# Altium project ALT0056 - Carnaval 2015 Universal PCB REV A.PrjPCB
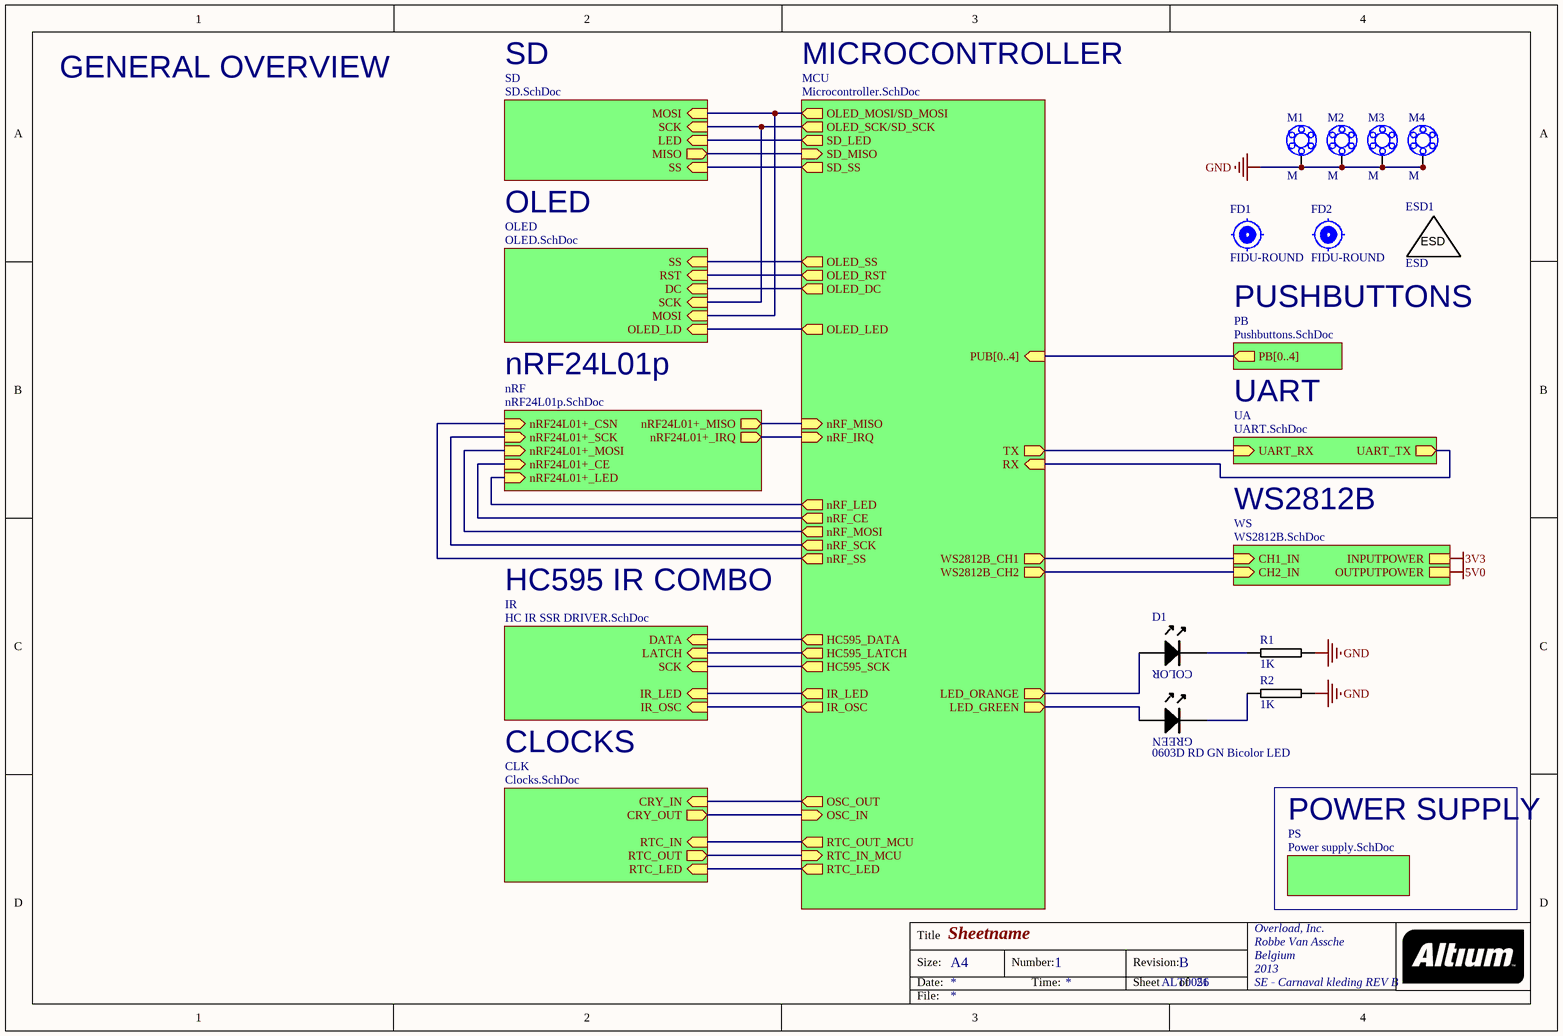
[diagram p0: General Overview.SchDoc]
21 sheets, 219 parts. Net scope: hierarchical (ports join the sheet entries above them; power ports are global).
Board file: PCB 2 layer 10 x 10.PcbDoc
Sheets:
  General Overview.SchDoc
    PS = Power supply.SchDoc
      BAT1 = Batterycharger.SchDoc
        CHRG = LEDs.SchDoc
        STBY = LEDs.SchDoc
      BAT2 = Batterycharger.SchDoc
        CHRG = LEDs.SchDoc
        STBY = LEDs.SchDoc
      3V30 = LEDs 0805.SchDoc
      5V00 = LEDs 0805.SchDoc
    WS = WS2812B.SchDoc
      CH1 = WS2812B Single Channel.SchDoc
      CH2 = WS2812B Single Channel.SchDoc
    PB = Pushbuttons.SchDoc
    MCU = Microcontroller.SchDoc
    UA = UART.SchDoc
    nRF = nRF24L01p.SchDoc
      nRFLED = LEDs.SchDoc
    IR = HC IR SSR DRIVER.SchDoc
      HC1 = HC595.SchDoc
      HC2 = HC595.SchDoc
      IRLED = LEDs.SchDoc
      IRL = IR LEDS.SchDoc
        NAND1 = Quad Nand.SchDoc
        NAND2 = Quad Nand.SchDoc
        IR0 = IR POWER STAGE.SchDoc
        IR1 = IR POWER STAGE.SchDoc
        IR2 = IR POWER STAGE.SchDoc
        IR3 = IR POWER STAGE.SchDoc
        IR4 = IR POWER STAGE.SchDoc
        IR5 = IR POWER STAGE.SchDoc
        IR6 = IR POWER STAGE.SchDoc
        IR7 = IR POWER STAGE.SchDoc
      SSR = SSR OUTPUTS.SchDoc
        SSR1 = SSR POWER STAGE.SchDoc
        SSR2 = SSR POWER STAGE.SchDoc
        SSR3 = SSR POWER STAGE.SchDoc
        SSR4 = SSR POWER STAGE.SchDoc
        SSR5 = SSR POWER STAGE.SchDoc
        SSR6 = SSR POWER STAGE.SchDoc
        SSR7 = SSR POWER STAGE.SchDoc
        SSR8 = SSR POWER STAGE.SchDoc
    CLK = Clocks.SchDoc
      RTCLED = LEDs.SchDoc
    SD = SD.SchDoc
      SDLED = LEDs.SchDoc
    OLED = OLED.SchDoc
      OLEDLED = LEDs.SchDoc

## Sheet General Overview.SchDoc: Sheetname
size A4; Organization: Overload, Inc.; Address1: Robbe Van Assche; Address2: Belgium; Address3: 2013; Address4: SE - Carnaval kleding REV B; DocumentNumber: 1; Revision: B; SheetNumber: ALT0056; SheetTotal: 21; PageSetup: Record=PageOptions|CenterHorizontal=True|CenterVertical=True|PrintScale=1.72|XCorrection=1.00|YCorrection=1.00|PrintKind=1|BorderSize=5000000|LeftOffset=0|BottomOffset=0|Orientation=2|PaperLength=1000|PaperWidth=1000|Scale=100|PaperSource=7|PrintQuality=-3|MediaType=1|DitherType=10|PrintScaleMode=1|PaperKind=A4|PaperIndex=9

### Parts
D1  0603D RD GN Bicolor LED  [0606LED BiCOLOR]
ESD1  ESD  [ESDSILK]  (no BOM)
FD1  FIDU-ROUND  [FIDU-ROUND]  (no BOM)
FD2  FIDU-ROUND  [FIDU-ROUND]  (no BOM)
M1  M  [MOUNTING]  (no BOM)
M2  M  [MOUNTING]  (no BOM)
M3  M  [MOUNTING]  (no BOM)
M4  M  [MOUNTING]  (no BOM)
R1  1K  [0603R-1k]
R2  1K  [0603R-1k]

### Sub-sheets
CLK = Clocks.SchDoc: RTC_IN (in), RTC_OUT (out), RTC_LED (in), CRY_IN (in), CRY_OUT (out)
IR = HC IR SSR DRIVER.SchDoc: SCK (in), LATCH (in), DATA (in), IR_OSC (in), IR_LED (in)
MCU = Microcontroller.SchDoc: RTC_LED (out), RTC_IN_MCU (in), RTC_OUT_MCU (out), OSC_IN (in), OSC_OUT (out), OLED_LED (out), SD_LED (out), TX (out), RX (in), SD_SS (out), OLED_SCK/SD_SCK (out), SD_MISO (in), OLED_MOSI/SD_MOSI (out), OLED_RST (out), OLED_DC (out), nRF_IRQ (in), nRF_CE (out), nRF_LED (out), nRF_SS (out), nRF_SCK (out), nRF_MISO (in), nRF_MOSI (out), WS2812B_CH1 (out), WS2812B_CH2 (out), OLED_SS (out), IR_LED (out), IR_OSC (out), HC595_DATA (out), HC595_LATCH (out), HC595_SCK (out), LED_GREEN (out), LED_ORANGE (out), PUB[0..4] (in)
nRF = nRF24L01p.SchDoc: nRF24L01+_CSN (in), nRF24L01+_SCK (in), nRF24L01+_MISO (out), nRF24L01+_MOSI (in), nRF24L01+_IRQ (out), nRF24L01+_CE (in), nRF24L01+_LED (in)
OLED = OLED.SchDoc: SS (in), RST (in), DC (in), SCK (in), MOSI (in), OLED_LD (in)
PB = Pushbuttons.SchDoc: PB[0..4] (out)
PS = Power supply.SchDoc: no entries
SD = SD.SchDoc: MOSI (in), SCK (in), MISO (out), SS (in), LED (in)
UA = UART.SchDoc: UART_RX (in), UART_TX (out)
WS = WS2812B.SchDoc: CH1_IN (in), CH2_IN (in), INPUTPOWER, OUTPUTPOWER

### Nets
GND: M1.1 M1.2 M1.3 M1.4 M1.5 M1.6 M1.7 M2.1 M2.2 M2.3 M2.4 M2.5 M2.6 M2.7 M3.1 M3.2 M3.3 M3.4 M3.5 M3.6 M3.7 M4.1 M4.2 M4.3 M4.4 M4.5 M4.6 M4.7 R1.2 R2.2
CH1_IN: sheet WS/CH1_IN, sheet MCU/WS2812B_CH1
CH2_IN: sheet WS/CH2_IN, sheet MCU/WS2812B_CH2
CRY_IN: sheet MCU/OSC_OUT, sheet CLK/CRY_IN
CRY_OUT: sheet MCU/OSC_IN, sheet CLK/CRY_OUT
DATA: sheet MCU/HC595_DATA, sheet IR/DATA
DC: sheet MCU/OLED_DC, sheet OLED/DC
HC595_LATCH: sheet MCU/HC595_LATCH, sheet IR/LATCH
HC595_SCK: sheet MCU/HC595_SCK, sheet IR/SCK
IR_LED: sheet MCU/IR_LED, sheet IR/IR_LED
IR_OSC: sheet MCU/IR_OSC, sheet IR/IR_OSC
LED: sheet MCU/SD_LED, sheet SD/LED
LED_GREEN: D1.A1 ; sheet MCU/LED_GREEN
LED_ORANGE: D1.A2 ; sheet MCU/LED_ORANGE
MISO: sheet MCU/SD_MISO, sheet SD/MISO
MOSI: sheet MCU/OLED_MOSI/SD_MOSI, sheet SD/MOSI, sheet OLED/MOSI
nRF24L01+_CE: sheet MCU/nRF_CE, sheet nRF/nRF24L01+_CE
nRF24L01+_CSN: sheet MCU/nRF_SS, sheet nRF/nRF24L01+_CSN
nRF24L01+_IRQ: sheet MCU/nRF_IRQ, sheet nRF/nRF24L01+_IRQ
nRF24L01+_LED: sheet MCU/nRF_LED, sheet nRF/nRF24L01+_LED
nRF24L01+_MISO: sheet MCU/nRF_MISO, sheet nRF/nRF24L01+_MISO
nRF24L01+_MOSI: sheet MCU/nRF_MOSI, sheet nRF/nRF24L01+_MOSI
nRF24L01+_SCK: sheet MCU/nRF_SCK, sheet nRF/nRF24L01+_SCK
OLED_LD: sheet MCU/OLED_LED, sheet OLED/OLED_LD
OLED_RST: sheet MCU/OLED_RST, sheet OLED/RST
OLED_SCK/SD_SCK: sheet MCU/OLED_SCK/SD_SCK, sheet SD/SCK, sheet OLED/SCK
OLED_SS: sheet MCU/OLED_SS, sheet OLED/SS
RTC_IN: sheet MCU/RTC_OUT_MCU, sheet CLK/RTC_IN
RTC_IN_MCU: sheet MCU/RTC_IN_MCU, sheet CLK/RTC_OUT
RTC_LED: sheet MCU/RTC_LED, sheet CLK/RTC_LED
RX: sheet MCU/RX, sheet UA/UART_TX
SD_SS: sheet MCU/SD_SS, sheet SD/SS
TX: sheet MCU/TX, sheet UA/UART_RX
NetD1_K1: D1.K1 R2.1
NetD1_K2: D1.K2 R1.1

### Buses and harness runs
bus sheet MCU/PUB[0..4] = sheet PB/PB[0..4]

### Notes on the sheet
- GENERAL OVERVIEW
- SD
- MICROCONTROLLER
- OLED
- PUSHBUTTONS
- nRF24L01p
- UART
- WS2812B
- HC595 IR COMBO
- CLOCKS
- POWER SUPPLY
- Title
- Size:
- Date:
- A4
- Number:
- Time:
- Revision:
- Sheet
- of
- File:
- (in symbol 0603D RD GN Bicolor LED) COLOR; GREEN

### Library data of the parts
D1 = 0603D RD GN Bicolor LED: Bicolor 0603 LED
ESD1 = ESD: ESD LOGO
FD1 FD2 = FIDU-ROUND: ROUND FIDUCIAL
M1-M4 = MOUNTING: MOUNTING HOLE - NON INSTALLABLE
R1 R2 = 0603R-1K: GENERIC RESISTOR 0603; Manufacturer Part Number: RMCF 1/16 1K 1% R; Manufacturer: Stackpole Electronics Inc; Reel: R14; Supplier 1: Digi-Key; Supplier Part Number 1: RMCF0603FT1K00TR-ND

## Sheet Power supply.SchDoc
size A4; DocumentNumber: 14; SheetNumber: ALT0056; SheetTotal: 21
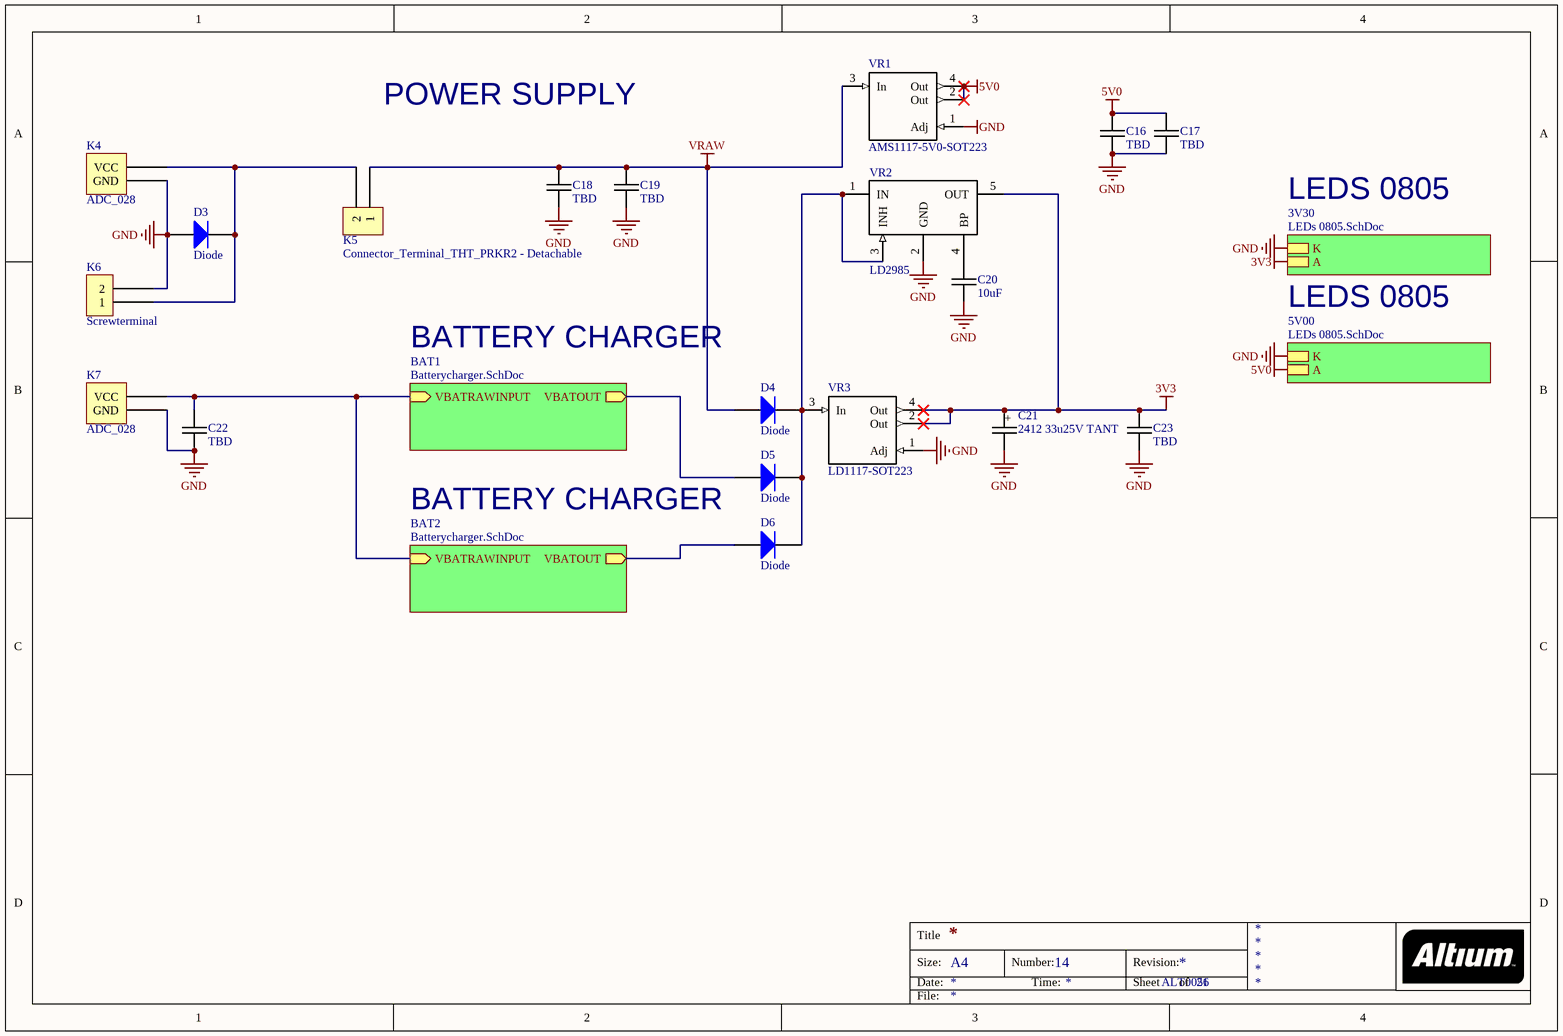
[diagram p1: Power supply.SchDoc]

### Parts
C16  TBD  [1210C-GENERIC]
C17  TBD  [1210C-GENERIC]
C18  TBD  [1210C-GENERIC]
C19  TBD  [1210C-GENERIC]
C20  10uF  [0603C-GENERIC]
C21  2412 33u25V TANT  [2412C+_TANTAL-33u25V]
C22  TBD  [1210C-GENERIC]
C23  TBD  [1210C-GENERIC]
D3  Diode  [SMB]
D4  Diode  [SMB]
D5  Diode  [SMB]
D6  Diode  [SMB]
K4  ADC_028  [ADC-028]
K5  Connector_Terminal_THT_PRKR2 - Detachable  [PRKR2-DET]
K6  Screwterminal  [PRKR2-DET]
K7  ADC_028  [ADC-028]
VR1  AMS1117-5V0-SOT223  [SOT223]
VR2  LD2985  [SOT23-5]
VR3  LD1117-SOT223  [SOT223]

### Sub-sheets
3V30 = LEDs 0805.SchDoc: K, A
5V00 = LEDs 0805.SchDoc: K, A
BAT1 = Batterycharger.SchDoc: VBATOUT (out), VBATRAWINPUT (in)
BAT2 = Batterycharger.SchDoc: VBATOUT (out), VBATRAWINPUT (in)

### Nets
3V3: C21.1 C23.1 VR2.5(OUT) VR3.2(Out) VR3.4(Out) ; sheet 3V30/A
5V0: C16.1 C17.1 VR1.2(Out) VR1.4(Out) ; sheet 5V00/A
GND: C16.2 C17.2 C18.2 C19.2 C20.2 C21.2 C22.2 C23.2 D3.1(A) K4.GND K6.2 K7.GND VR1.1(Adj) VR2.2(GND) VR3.1(Adj) ; sheet 3V30/K, sheet 5V00/K
VRAW: C18.1 C19.1 D4.1(A) K5.1 VR1.3(In)
VBATOUT: D5.1(A) ; sheet BAT1/VBATOUT
VBATOUT: D6.1(A) ; sheet BAT2/VBATOUT  [a separate net that carries the same name]
VBATRAWINPUT: C22.1 K7.VCC ; sheet BAT1/VBATRAWINPUT, sheet BAT2/VBATRAWINPUT
NetC20_1: C20.1 VR2.4(BP)
NetD3_2: D3.2(K) K4.VCC K5.2 K6.1
NetD4_2: D4.2(K) D5.2(K) D6.2(K) VR2.1(IN) VR2.3(INH) VR3.3(In)

### Notes on the sheet
- POWER SUPPLY
- LEDS 0805
- BATTERY CHARGER
- Title
- Size:
- Date:
- A4
- Number:
- Time:
- Revision:
- Sheet
- of
- File:
- (in symbol 2412C-TANTAL SIZE C-33u25V) +

### Library data of the parts
C16-C19 C22 C23 = Passives_Capacitors_1210_1210C-TBD: CAPACITOR 1210 CERAMIC VALUE TO BE DETERMINED
C20 = 0603C-10UF-10V-X5R-TDK: CAPACITOR 0603 CERAMIC; Manufacturer Part Number: C1608X5R0J106M; Manufacturer: TDK Corporation; Reel: C31; Supplier 1: Digi-Key; Supplier Part Number 1: 445-4112-2-ND
C21 = 2412C-TANTAL SIZE C-33u25V
D3-D6 = Diode: Default Diode; Published: 8-Jun-2000; LatestRevisionDate: 17-Jul-2002; LatestRevisionNote: Re-released for DXP Platform.; PackageVersion: Sep-1996; PackageReference: SMC; Publisher: Altium Limited; PackageDescription: DO-214-AB/SMC; 2 C-Bend Leads; Body 7.9 x 5.9 mm, inc. leads (LxW); Code_JEDEC: DO-214-AB
K4 K7 = ADC_028: 5.5mm SMD
K6 = Connector_Terminal_THT_PRKR2 - Detachable
VR1 = LD1117-SOT223
VR2 = LD2985: Low Noise Low Drop Voltage Regulator  with Inhibit; Text Field1: ST; Text Field2: LK112SM33TR; Text Field3: ST; Text Field4: LK112SM33TR

## Sheet Batterycharger.SchDoc
size A4; DocumentNumber: 15; SheetNumber: ALT0056; SheetTotal: 21
Used 2 times, as channels PS/BAT1, PS/BAT2. Parts and nets are listed once, with the designators drawn on the sheet.
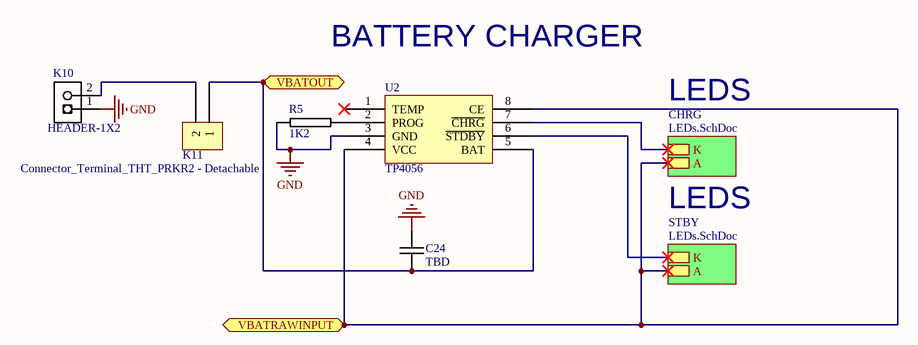
[diagram p2: Batterycharger.SchDoc]

### Parts
C24  TBD  [1210C-GENERIC]
K10  HEADER-1X2  [HEADER-1X2]
K11  Connector_Terminal_THT_PRKR2 - Detachable  [PRKR2-DET]
R5  1K2  [0603R-GENERIC]
U2  TP4056  [SO8_N]

### Sub-sheets
CHRG = LEDs.SchDoc: K, A
STBY = LEDs.SchDoc: K, A

### Ports
VBATOUT (out), VBATRAWINPUT (in)

### Nets
GND: C24.1 K10.1 R5.1 U2.3(GND)
VBATOUT: C24.2 K11.1 U2.5(BAT) ; port VBATOUT
VBATRAWINPUT: U2.4(VCC) U2.8(CE) ; port VBATRAWINPUT, sheet CHRG/A, sheet STBY/A
NetK10_2: K10.2 K11.2
NetR5_2: R5.2 U2.2(PROG)
NetU2_6: U2.6(~{STDBY}) ; sheet STBY/K
NetU2_7: U2.7(~{CHRG}) ; sheet CHRG/K

Not connected (* = marked no-connect by the designer): U2 1(TEMP)*

### Channels
PS/BAT1: designators end in A; ports VBATOUT=VBATOUT VBATRAWINPUT=VBATRAWINPUT
PS/BAT2: designators end in B; ports VBATOUT=VBATOUT VBATRAWINPUT=VBATRAWINPUT

### Notes on the sheet
- BATTERY CHARGER
- LEDS
- Title
- Size:
- Date:
- A4
- Number:
- Time:
- Revision:
- Sheet
- of
- File:

### Library data of the parts
C24 = Passives_Capacitors_1210_1210C-TBD: as C16 on sheet Power supply
K10 = HEADER-1X2: REEL: TH; Supplier 1: Digi-Key; Supplier Part Number 1: S1011E-36-ND
R5 = 0603R-1K2: GENERIC RESISTOR 0603; Manufacturer Part Number: RMCF 1/16 1.2K 1% R; Manufacturer: Stackpole Electronics Inc; Reel: R75; Supplier 1: Digi-Key; Supplier Part Number 1: RMCF0603FT1K20TR-ND

## Sheet LEDs.SchDoc
size A4; DocumentNumber: 3; SheetNumber: ALT0056; SheetTotal: 21
Used 9 times, as channels PS/BAT1/CHRG, PS/BAT1/STBY, PS/BAT2/CHRG, PS/BAT2/STBY, nRF/nRFLED, IR/IRLED, CLK/RTCLED, SD/SDLED, OLED/OLEDLED. Parts and nets are listed once, with the designators drawn on the sheet.
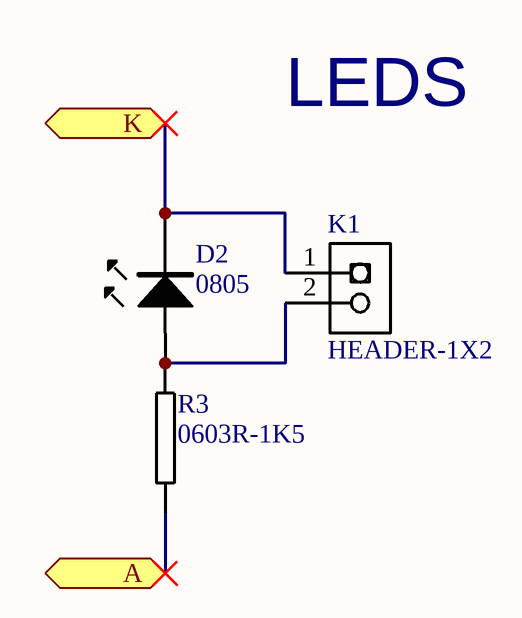
[diagram p3: LEDs.SchDoc]

### Parts
D2  0805  [0805LED]
K1  HEADER-1X2  [HEADER-1X2]
R3  0603R-1K5  [0603R-1k5]

### Ports
A, K

### Nets
A: R3.2 ; port A
K: D2.K K1.1 ; port K
NetD2_A: D2.A K1.2 R3.1

### Channels
PS/BAT1/CHRG: designators end in A; ports A=VBATRAWINPUT K=K
PS/BAT1/STBY: designators end in B; ports A=VBATRAWINPUT K=K
PS/BAT2/CHRG: designators end in C; ports A=VBATRAWINPUT K=K
PS/BAT2/STBY: designators end in D; ports A=VBATRAWINPUT K=K
nRF/nRFLED: designators end in E; ports A=nRF24L01+_LED K=GND
IR/IRLED: designators end in F; ports A=IR_LED K=GND
CLK/RTCLED: designators end in G; ports A=RTC_LED K=GND
SD/SDLED: designators end in H; ports A=LED K=GND
OLED/OLEDLED: designators end in I; ports A=OLED_LD K=GND

### Notes on the sheet
- LEDS
- Title
- Size:
- Date:
- A4
- Number:
- Time:
- Revision:
- Sheet
- of
- File:

### Library data of the parts
D2 = 0805_LED
K1 = HEADER-1X2: REEL: TH; Supplier 1: Digi-Key; Supplier Part Number 1: S1011E-36-ND
R3 = 0603R-1K5: GENERIC RESISTOR 0603; Manufacturer Part Number: RMCF 1/16 15K 1% R; Manufacturer: Stackpole Electronics Inc; Tolerance: ±1%; Resistance In Ohms: 15.0K; Power (Watts): 0.1W, 1/10W; Temperature Coefficient: ±100ppm/°C; Supplier 1: Digi-Key; Supplier Part Number 1: RMCF1/1615KFRTR-ND; Supplier: Digi-Key; Supplier Part Number: RMCF1/1615KFRTR-ND; Packaging: Tape & Reel (TR); Category: Resistors; Case: 0603 (1608 metric); Composition: Thick Film; Lead Style: Surface Mount (SMD - SMT); RoHS: RoHS Compliant

## Sheet LEDs 0805.SchDoc
size A4; Organization: Altium Limited; Address1: L3, 12a Rodborough Rd; Address2: Frenchs Forest; Address3: NSW; Address4: Australia 2086; DocumentNumber: 16; SheetNumber: ALT0056; SheetTotal: 21
Used 2 times, as channels PS/3V30, PS/5V00. Parts and nets are listed once, with the designators drawn on the sheet.
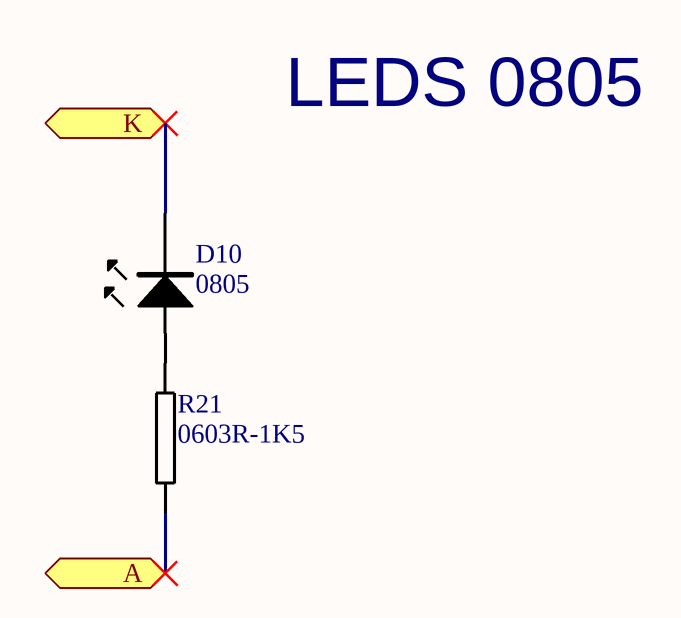
[diagram p4: LEDs 0805.SchDoc]

### Parts
D10  0805  [0805LED]
R21  0603R-1K5  [0603R-1k5]

### Ports
A, K

### Nets
A: R21.2 ; port A
K: D10.K ; port K
NetD10_A: D10.A R21.1

### Channels
PS/3V30: designators end in A; ports A=3V3 K=GND
PS/5V00: designators end in B; ports A=5V0 K=GND

### Notes on the sheet
- LEDS 0805
- Title
- Size:
- Date:
- A4
- Number:
- Time:
- Revision:
- Sheet
- of
- File:

### Library data of the parts
D10 = 0805_LED
R21 = 0603R-1K5: as R3 on sheet LEDs; Supplier 1: Digi-Key; Supplier Part Number 1: RMCF1/1615KFRTR-ND; Supplier: Digi-Key; Supplier Part Number: RMCF1/1615KFRTR-ND; Packaging: Tape & Reel (TR); Category: Resistors; Case: 0603 (1608 metric); Composition: Thick Film; Lead Style: Surface Mount (SMD - SMT); RoHS: RoHS Compliant

## Sheet WS2812B.SchDoc
size A4; DocumentNumber: 20; SheetNumber: ALT0056; SheetTotal: 21
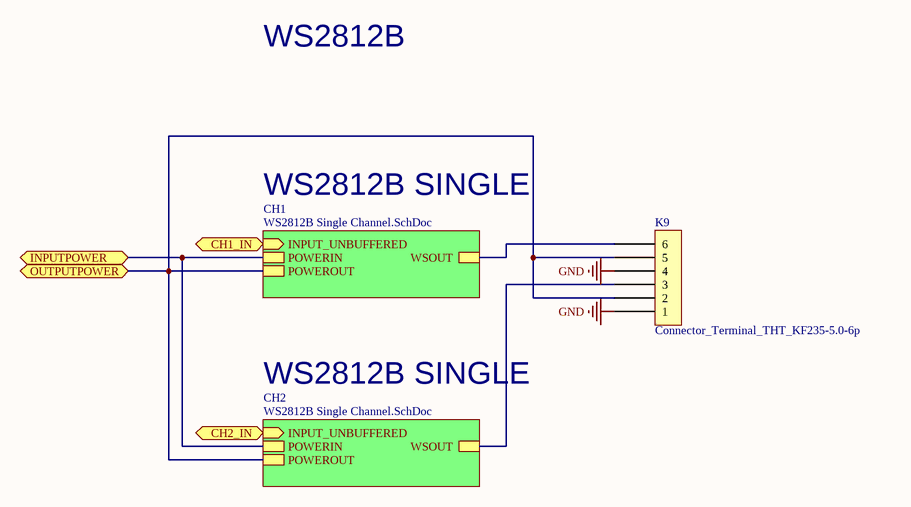
[diagram p5: WS2812B.SchDoc]

### Parts
K9  Connector_Terminal_THT_KF235-5.0-6p  [KF235-5.0-6p]

### Sub-sheets
CH1 = WS2812B Single Channel.SchDoc: INPUT_UNBUFFERED (in), POWERIN, POWEROUT, WSOUT
CH2 = WS2812B Single Channel.SchDoc: INPUT_UNBUFFERED (in), POWERIN, POWEROUT, WSOUT

### Ports
CH1_IN (in), CH2_IN (in), INPUTPOWER, OUTPUTPOWER

### Nets
3V3: port INPUTPOWER, sheet CH1/POWERIN, sheet CH2/POWERIN
5V0: K9.2 K9.5 ; port OUTPUTPOWER, sheet CH1/POWEROUT, sheet CH2/POWEROUT
GND: K9.1 K9.4
CH1_IN: port CH1_IN, sheet CH1/INPUT_UNBUFFERED
CH2_IN: port CH2_IN, sheet CH2/INPUT_UNBUFFERED
WSOUT: K9.6 ; sheet CH1/WSOUT
WSOUT: K9.3 ; sheet CH2/WSOUT  [a separate net that carries the same name]

### Notes on the sheet
- WS2812B
- WS2812B SINGLE
- Title
- Size:
- Date:
- A4
- Number:
- Time:
- Revision:
- Sheet
- of
- File:

## Sheet WS2812B Single Channel.SchDoc
size A4; DocumentNumber: 21; SheetNumber: ALT0056; SheetTotal: 21
Used 2 times, as channels WS/CH1, WS/CH2. Parts and nets are listed once, with the designators drawn on the sheet.
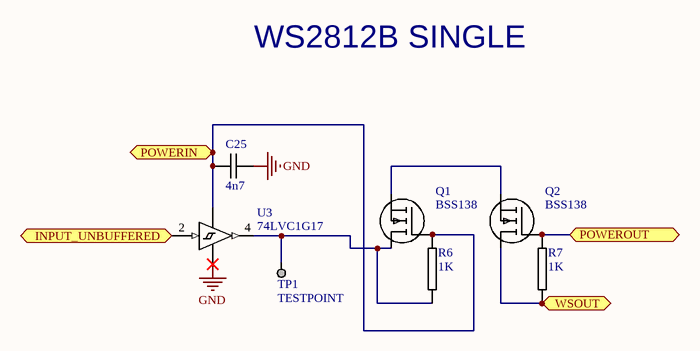
[diagram p6: WS2812B Single Channel.SchDoc]

### Parts
C25  4n7  [0603C-TBD]
Q1  BSS138  [SOT23-GDS]
Q2  BSS138  [SOT23-GDS]
R6  1K  [0603R-1k]
R7  1K  [0603R-1k]
TP1  TESTPOINT  [TESTPOINT]
U3  74LVC1G17  [SOT-353]

### Ports
INPUT_UNBUFFERED (in), POWERIN, POWEROUT, WSOUT

### Nets
GND: C25.2 U3.3(GND)
INPUT_UNBUFFERED: U3.2(A) ; port INPUT_UNBUFFERED
POWERIN: C25.1 Q1.G R6.1 U3.5(VCC) ; port POWERIN
POWEROUT: Q2.G R7.1 ; port POWEROUT
WSOUT: Q2.D R7.2 ; port WSOUT
NetQ1_D: Q1.D R6.2 TP1.1 U3.4(Y)
NetQ1_S: Q1.S Q2.S

### Channels
WS/CH1: designators end in A; ports INPUT_UNBUFFERED=CH1_IN POWERIN=3V3 POWEROUT=5V0 WSOUT=WSOUT
WS/CH2: designators end in B; ports INPUT_UNBUFFERED=CH2_IN POWERIN=3V3 POWEROUT=5V0 WSOUT=WSOUT

### Notes on the sheet
- WS2812B SINGLE
- Title
- Size:
- Date:
- A4
- Number:
- Time:
- Revision:
- Sheet
- of
- File:

### Library data of the parts
C25 = 0603C-4N7: CAPACITOR 0603 CERAMIC; REEL: C83; Supplier 1: Digi-Key; Supplier Part Number 1: 445-5086-2-ND
Q1 Q2 = BSS138-SOT23: N CHANNEL MOSFET BSS138 SOT23; Manufacturer: Fairchild Semiconductor; Manufacturer Part Number: 2N7002; Drain to Source Voltage (Vdss): 60V; Vgs(th) (Max) @ Id: 2.5V @ 250µA; Power - Max: 200mW; Current - Continuous Drain (Id) @ 25° C: 115mA; Rds On (Max) @ Id, Vgs: 7.5 Ohm @ 500mA, 10V; FET Type: MOSFET N-Channel, Metal Oxide; FET Feature: Logic Level Gate; Input Capacitance (Ciss) @ Vds: 50pF @ 25V; Reel: Q2; Supplier 1: Digi-Key; Supplier Part Number 1: 2N7002NTR-ND; Package / Case: SOT-23-3, TO-236-3, Micro3™, SSD3, SST3; RoHS: RoHS Compliant; Mounting Type: Surface Mount; Packaging: Tape & Reel (TR); Gate Charge (Qg) @ Vgs: -; Supplier Part Number: 2N7002NTR-ND; Supplier: Digi-Key; Category: Discrete Semiconductor Products
R6 R7 = 0603R-1K: as R1 on sheet General Overview; Supplier 1: Digi-Key; Supplier Part Number 1: RMCF0603FT1K00TR-ND
TP1 = TESTPOINT: TESTPOINT SCOPE GRABBER; Manufacturer Part Number: 5010; Manufacturer: Keystone Electronics; Reel: TH; Supplier 1: Digi-Key; Supplier Part Number 1: 5010K-ND
U3 = 74LVC1G17: Single buffer

## Sheet Pushbuttons.SchDoc
size A4; DocumentNumber: 17; SheetNumber: ALT0056; SheetTotal: 21
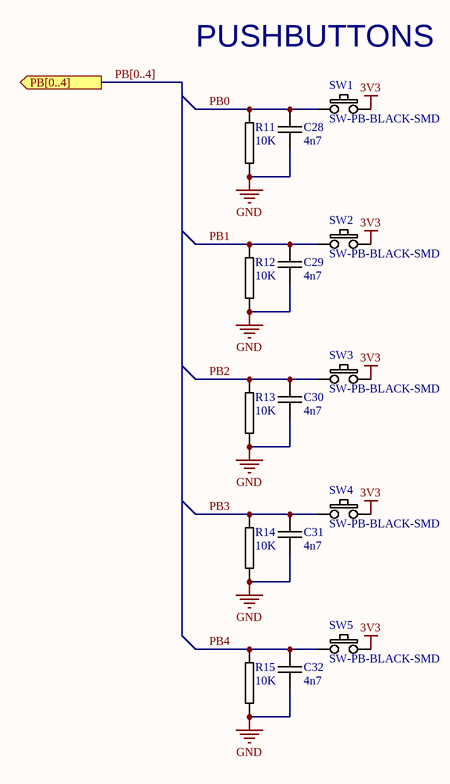
[diagram p7: Pushbuttons.SchDoc]

### Parts
C28  4n7  [0603C-TBD]
C29  4n7  [0603C-TBD]
C30  4n7  [0603C-TBD]
C31  4n7  [0603C-TBD]
C32  4n7  [0603C-TBD]
R11  10K  [0603R-10K]
R12  10K  [0603R-10K]
R13  10K  [0603R-10K]
R14  10K  [0603R-10K]
R15  10K  [0603R-10K]
SW1  SW-PB-BLACK-SMD  [SW-PB-SMD]
SW2  SW-PB-BLACK-SMD  [SW-PB-SMD]
SW3  SW-PB-BLACK-SMD  [SW-PB-SMD]
SW4  SW-PB-BLACK-SMD  [SW-PB-SMD]
SW5  SW-PB-BLACK-SMD  [SW-PB-SMD]

### Ports
PB[0..4] (out)

### Nets
3V3: SW1.2 SW2.2 SW3.2 SW4.2 SW5.2
GND: C28.2 C29.2 C30.2 C31.2 C32.2 R11.2 R12.2 R13.2 R14.2 R15.2
PB0: C28.1 R11.1 SW1.1
PB1: C29.1 R12.1 SW2.1
PB2: C30.1 R13.1 SW3.1
PB3: C31.1 R14.1 SW4.1
PB4: C32.1 R15.1 SW5.1

### Buses and harness runs
bus PB[0..4] = port PB[0..4]

### Notes on the sheet
- PUSHBUTTONS
- Title
- Size:
- Date:
- A4
- Number:
- Time:
- Revision:
- Sheet
- of
- File:

### Library data of the parts
C28-C32 = 0603C-4N7: CAPACITOR 0603 CERAMIC; REEL: C83; Supplier 1: Digi-Key; Supplier Part Number 1: 445-5086-2-ND
R11-R15 = 0603R-10K: GENERIC RESISTOR 0603; Manufacturer: Stackpole Electronics Inc; Manufacturer Part Number: RMCF 1/16 10K 1% R; Tolerance: ±1%; Power (Watts): 0.1W, 1/10W; Temperature Coefficient: ±100ppm/°C; Resistance In Ohms: 10.0K; Reel: R21; Category: Resistors; Supplier Part Number: RMCF1/1610KFRDKR-ND; Lead Style: Surface Mount (SMD - SMT); RoHS: RoHS Compliant; Packaging: Digi-Reel®; Case: 0603 (1608 metric); Composition: Thick Film; Supplier: Digi-Key; Supplier 1: Digi-Key; Supplier Part Number 1: RMCF0603FT10K0DKR-ND
SW1-SW5 = SW-PB-BLACK-SMD: PUSHBUTTON SWITCH 6MM SMD

## Sheet Microcontroller.SchDoc
size A4; DocumentNumber: 11; SheetNumber: ALT0056; SheetTotal: 21
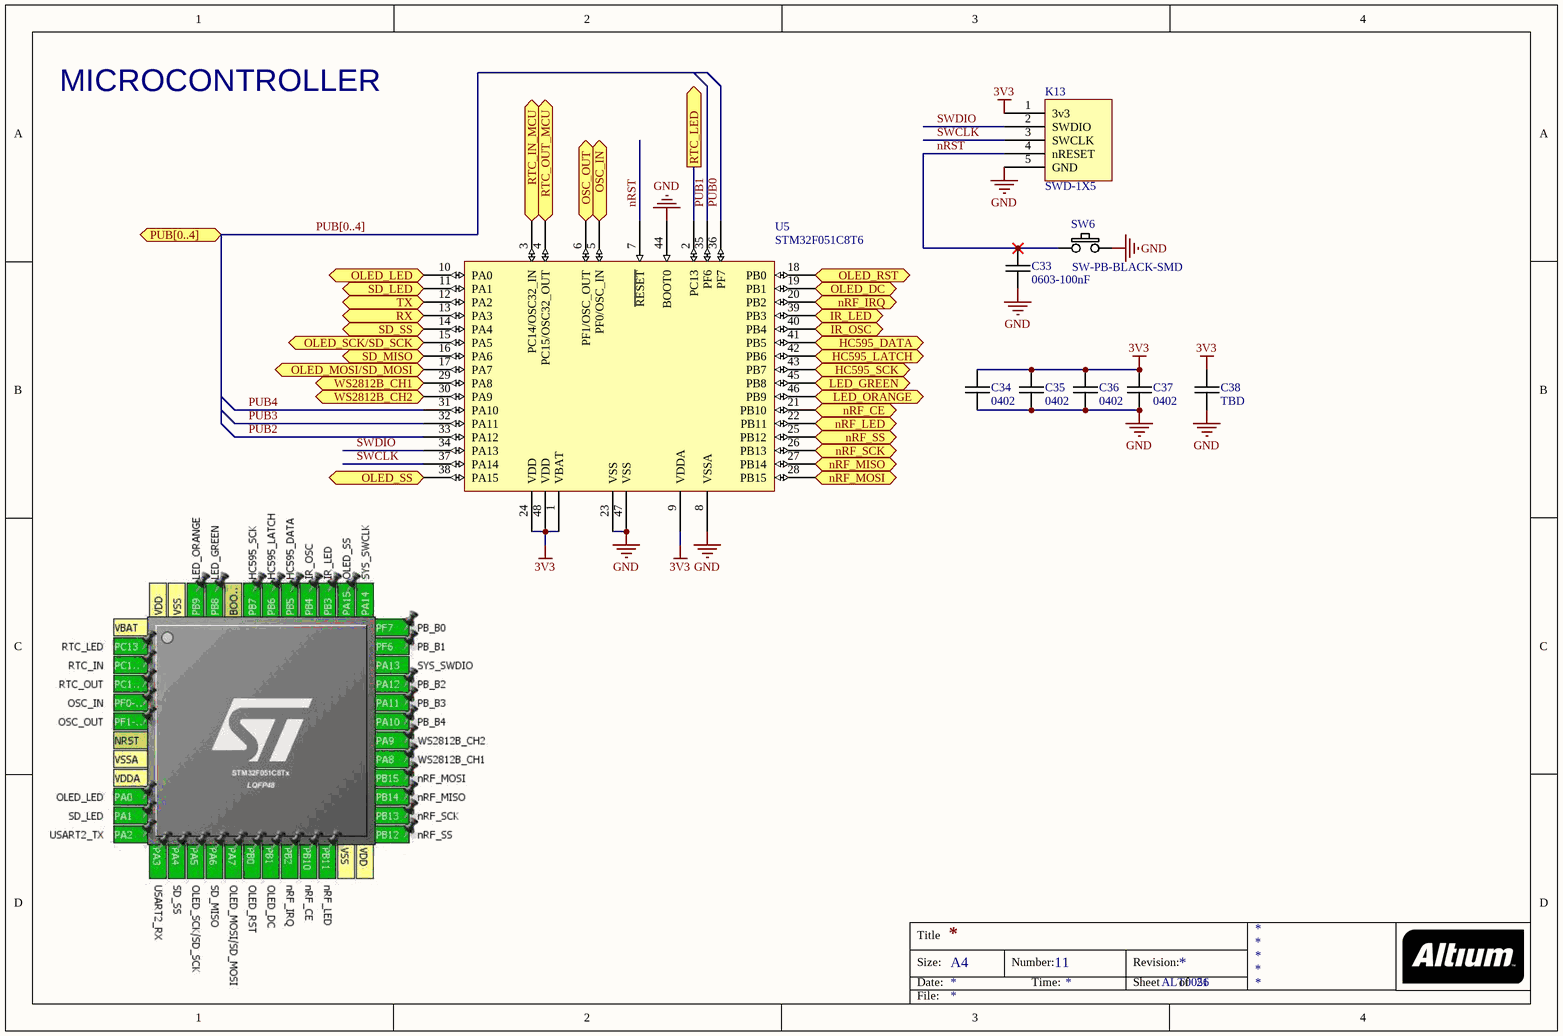
[diagram p8: Microcontroller.SchDoc]

### Parts
C33  0603-100nF  [0603C-TBD]
C34  0402  [0402C-TBD]
C35  0402  [0402C-TBD]
C36  0402  [0402C-TBD]
C37  0402  [0402C-TBD]
C38  TBD  [1210C-GENERIC]
K13  SWD-1X5  [HEADER-1X5]
SW6  SW-PB-BLACK-SMD  [SW-PB-SMD]
U5  STM32F051C8T6  [LQFP48_N]

### Ports
HC595_DATA (out), HC595_LATCH (out), HC595_SCK (out), IR_LED (out), IR_OSC (out), LED_GREEN (out), LED_ORANGE (out), nRF_CE (out), nRF_IRQ (in), nRF_LED (out), nRF_MISO (in), nRF_MOSI (out), nRF_SCK (out), nRF_SS (out), OLED_DC (out), OLED_LED (out), OLED_MOSI/SD_MOSI (out), OLED_RST (out), OLED_SCK/SD_SCK (out), OLED_SS (out), OSC_IN (in), OSC_OUT (out), PUB[0..4] (in), RTC_IN_MCU (in), RTC_LED (out), RTC_OUT_MCU (out), RX (in), SD_LED (out), SD_MISO (in), SD_SS (out), TX (out), WS2812B_CH1 (out), WS2812B_CH2 (out)

### Nets
3V3: C34.1 C35.1 C36.1 C37.1 C38.1 K13.1(3v3) U5.1(VBAT) U5.9(VDDA) U5.24(VDD) U5.48(VDD)
GND: C33.2 C34.2 C35.2 C36.2 C37.2 C38.2 K13.5(GND) SW6.2 U5.8(VSSA) U5.23(VSS) U5.44(BOOT0) U5.47(VSS)
CH1_IN: U5.29(PA8) ; port WS2812B_CH1
CH2_IN: U5.30(PA9) ; port WS2812B_CH2
CRY_IN: U5.6(PF1/OSC_OUT) ; port OSC_OUT
CRY_OUT: U5.5(PF0/OSC_IN) ; port OSC_IN
DATA: U5.41(PB5) ; port HC595_DATA
DC: U5.19(PB1) ; port OLED_DC
HC595_LATCH: U5.42(PB6) ; port HC595_LATCH
HC595_SCK: U5.43(PB7) ; port HC595_SCK
IR_LED: U5.39(PB3) ; port IR_LED
IR_OSC: U5.40(PB4) ; port IR_OSC
LED: U5.11(PA1) ; port SD_LED
LED_GREEN: U5.45(PB8) ; port LED_GREEN
LED_ORANGE: U5.46(PB9) ; port LED_ORANGE
MISO: U5.16(PA6) ; port SD_MISO
MOSI: U5.17(PA7) ; port OLED_MOSI/SD_MOSI
nRF24L01+_CE: U5.21(PB10) ; port nRF_CE
nRF24L01+_CSN: U5.25(PB12) ; port nRF_SS
nRF24L01+_IRQ: U5.20(PB2) ; port nRF_IRQ
nRF24L01+_LED: U5.22(PB11) ; port nRF_LED
nRF24L01+_MISO: U5.27(PB14) ; port nRF_MISO
nRF24L01+_MOSI: U5.28(PB15) ; port nRF_MOSI
nRF24L01+_SCK: U5.26(PB13) ; port nRF_SCK
nRST: C33.1 K13.4(nRESET) SW6.1 U5.7(~{RESET})  [project net nRST_ALT0056]
OLED_LD: U5.10(PA0) ; port OLED_LED
OLED_RST: U5.18(PB0) ; port OLED_RST
OLED_SCK/SD_SCK: U5.15(PA5) ; port OLED_SCK/SD_SCK
OLED_SS: U5.38(PA15) ; port OLED_SS
PUB0: U5.36(PF7)  [project net PB0]
PUB1: U5.35(PF6)  [project net PB1]
PUB2: U5.33(PA12)  [project net PB2]
PUB3: U5.32(PA11)  [project net PB3]
PUB4: U5.31(PA10)  [project net PB4]
RTC_IN: U5.4(PC15/OSC32_OUT) ; port RTC_OUT_MCU
RTC_IN_MCU: U5.3(PC14/OSC32_IN) ; port RTC_IN_MCU
RTC_LED: U5.2(PC13) ; port RTC_LED
RX: U5.13(PA3) ; port RX
SD_SS: U5.14(PA4) ; port SD_SS
SWCLK: K13.3(SWCLK) U5.37(PA14)  [project net SWCLK_ALT0056]
SWDIO: K13.2(SWDIO) U5.34(PA13)  [project net SWDIO_ALT0056]
TX: U5.12(PA2) ; port TX

### Buses and harness runs
bus PUB[0..4] = port PUB[0..4]

### Notes on the sheet
- MICROCONTROLLER
- Title
- Size:
- Date:
- A4
- Number:
- Time:
- Revision:
- Sheet
- of
- File:

### Library data of the parts
C33 = 0603C-TBD: CAPACITOR 0603 CERAMIC VALUE TO BE DETERMINED; REEL: *
C34-C37 = 0402C-TBD: CAPACITOR 0402 CERAMIC
C38 = Passives_Capacitors_1210_1210C-TBD: as C16 on sheet Power supply
K13 = SWD-1X5: SWD PINHEADER 1X5; REEL: TH; Supplier 1: Digi-Key; Supplier Part Number 1: S1011E-36-ND
SW6 = SW-PB-BLACK-SMD: PUSHBUTTON SWITCH 6MM SMD

## Sheet UART.SchDoc
size A4; DocumentNumber: 19; SheetNumber: ALT0056; SheetTotal: 21
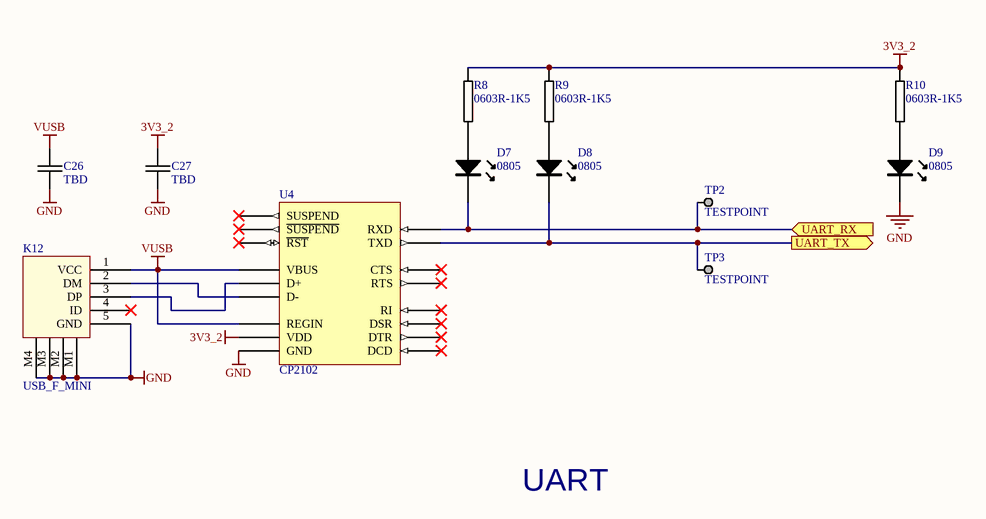
[diagram p9: UART.SchDoc]

### Parts
C26  TBD  [1210C-GENERIC]
C27  TBD  [1210C-GENERIC]
D7  0805  [0805LED]
D8  0805  [0805LED]
D9  0805  [0805LED]
K12  USB_F_MINI  [USB_F_MINI]
R8  0603R-1K5  [0603R-1k5]
R9  0603R-1K5  [0603R-1k5]
R10  0603R-1K5  [0603R-1k5]
TP2  TESTPOINT  [TESTPOINT]
TP3  TESTPOINT  [TESTPOINT]
U4  CP2102  [QFN-28]

### Ports
UART_RX (in), UART_TX (out)

### Nets
3V3_2: C27.1 R8.1 R9.1 R10.1 U4.6(VDD)
GND: C26.2 C27.2 D9.K K12.5(GND) K12.M1 K12.M2 K12.M3 K12.M4 U4.3(GND)
VUSB: C26.1 K12.1(VCC) U4.7(REGIN) U4.8(VBUS)
RX: D8.K TP3.1 U4.26(TXD) ; port UART_TX
TX: D7.K TP2.1 U4.25(RXD) ; port UART_RX
NetD7_A: D7.A R8.2
NetD8_A: D8.A R9.2
NetD9_A: D9.A R10.2
NetK12_2: K12.2(DM) U4.5(D-)
NetK12_3: K12.3(DP) U4.4(D+)

Not connected (* = marked no-connect by the designer): K12 4(ID)*; U4 1(DCD)* 2(RI)* 9(~{RST})* 11(~{SUSPEND})* 12(SUSPEND)* 23(CTS)* 24(RTS)* 27(DSR)* 28(DTR)*

### Notes on the sheet
- UART
- Title
- Size:
- Date:
- A4
- Number:
- Time:
- Revision:
- Sheet
- of
- File:

### Library data of the parts
C26 C27 = Passives_Capacitors_1210_1210C-TBD: as C16 on sheet Power supply
D7-D9 = 0805_LED
K12 = USB_F_MINI: MINI USB B FEMALE
R8-R10 = 0603R-1K5: as R3 on sheet LEDs; Supplier 1: Digi-Key; Supplier Part Number 1: RMCF1/1615KFRTR-ND; Supplier: Digi-Key; Supplier Part Number: RMCF1/1615KFRTR-ND; Packaging: Tape & Reel (TR); Category: Resistors; Case: 0603 (1608 metric); Composition: Thick Film; Lead Style: Surface Mount (SMD - SMT); RoHS: RoHS Compliant
TP2 TP3 = TESTPOINT: as TP1 on sheet WS2812B Single Channel; Supplier 1: Digi-Key; Supplier Part Number 1: 5010K-ND

## Sheet nRF24L01p.SchDoc
size A4; DocumentNumber: 12; SheetNumber: ALT0056; SheetTotal: 21
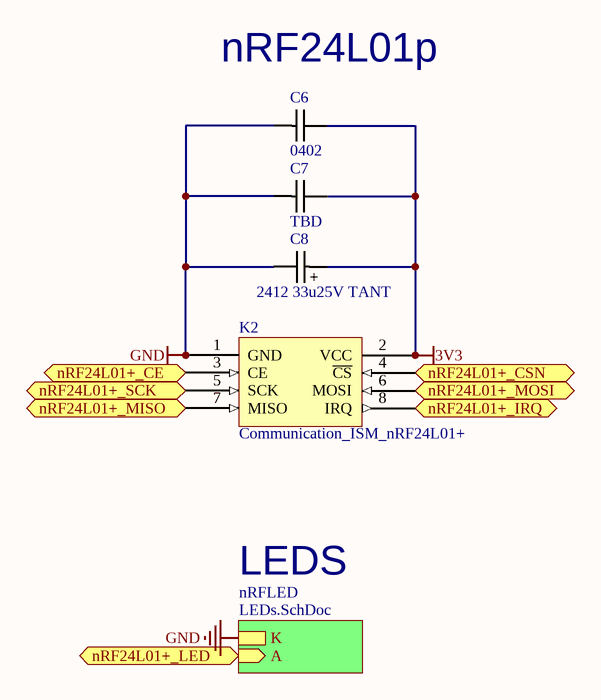
[diagram p10: nRF24L01p.SchDoc]

### Parts
C6  0402  [0402C-TBD]
C7  TBD  [1210C-GENERIC]
C8  2412 33u25V TANT  [2412C+_TANTAL-33u25V]
K2  Communication_ISM_nRF24L01+  [nRF24L01+_SMD]

### Sub-sheets
nRFLED = LEDs.SchDoc: K, A (in)

### Ports
nRF24L01+_CE (in), nRF24L01+_CSN (in), nRF24L01+_IRQ (out), nRF24L01+_LED (in), nRF24L01+_MISO (out), nRF24L01+_MOSI (in), nRF24L01+_SCK (in)

### Nets
3V3: C6.2 C7.2 C8.1 K2.2(VCC)
GND: C6.1 C7.1 C8.2 K2.1(GND) ; sheet nRFLED/K
nRF24L01+_CE: K2.3(CE) ; port nRF24L01+_CE
nRF24L01+_CSN: K2.4(~{CS}) ; port nRF24L01+_CSN
nRF24L01+_IRQ: K2.8(IRQ) ; port nRF24L01+_IRQ
nRF24L01+_LED: port nRF24L01+_LED, sheet nRFLED/A
nRF24L01+_MISO: K2.7(MISO) ; port nRF24L01+_MISO
nRF24L01+_MOSI: K2.6(MOSI) ; port nRF24L01+_MOSI
nRF24L01+_SCK: K2.5(SCK) ; port nRF24L01+_SCK

### Notes on the sheet
- (near C6) nRF24L01p
- LEDS
- Title
- Size:
- Date:
- A4
- Number:
- Time:
- Revision:
- Sheet
- of
- File:
- (in symbol 2412C-TANTAL SIZE C-33u25V) +

### Library data of the parts
C6 = 0402C-TBD: CAPACITOR 0402 CERAMIC
C7 = Passives_Capacitors_1210_1210C-TBD: as C16 on sheet Power supply
C8 = 2412C-TANTAL SIZE C-33u25V
K2 = Communication_ISM_nRF24L01+: nRF24L01+

## Sheet HC IR SSR DRIVER.SchDoc
size A4; DocumentNumber: 4; SheetNumber: ALT0056; SheetTotal: 21
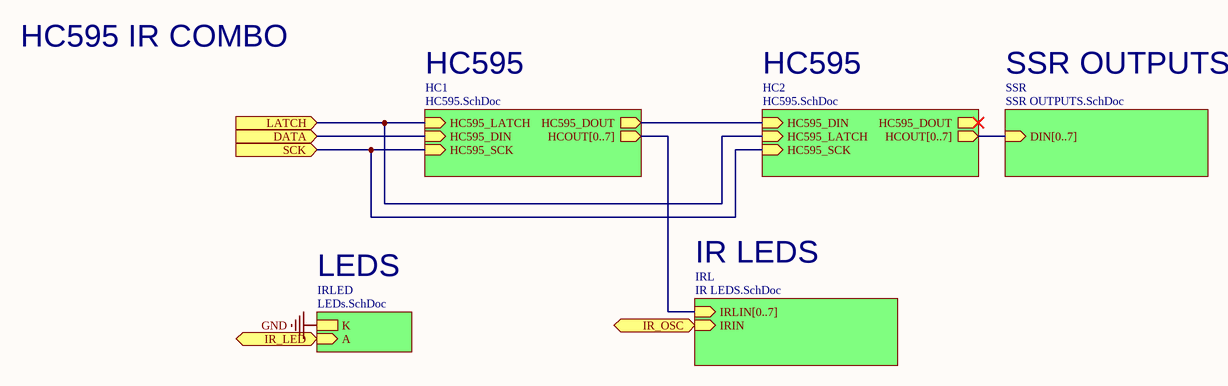
[diagram p11: HC IR SSR DRIVER.SchDoc]

### Sub-sheets
HC1 = HC595.SchDoc: HC595_LATCH (in), HC595_DIN (in), HC595_SCK (in), HC595_DOUT (out), HCOUT[0..7] (out)
HC2 = HC595.SchDoc: HC595_LATCH (in), HC595_DIN (in), HC595_SCK (in), HCOUT[0..7] (out), HC595_DOUT (out)
IRL = IR LEDS.SchDoc: IRLIN[0..7] (in), IRIN (in)
IRLED = LEDs.SchDoc: K, A (in)
SSR = SSR OUTPUTS.SchDoc: DIN[0..7] (in)

### Ports
DATA (in), IR_LED (in), IR_OSC (in), LATCH (in), SCK (in)

### Nets
DATA: port DATA, sheet HC1/HC595_DIN
HC595_DIN: sheet HC1/HC595_DOUT, sheet HC2/HC595_DIN
HC595_LATCH: port LATCH, sheet HC1/HC595_LATCH, sheet HC2/HC595_LATCH
HC595_SCK: port SCK, sheet HC1/HC595_SCK, sheet HC2/HC595_SCK
IR_LED: port IR_LED, sheet IRLED/A
IR_OSC: port IR_OSC, sheet IRL/IRIN

### Buses and harness runs
bus sheet HC1/HCOUT[0..7] = sheet IRL/IRLIN[0..7]
bus sheet HC2/HCOUT[0..7] = sheet SSR/DIN[0..7]

### Notes on the sheet
- HC595 IR COMBO
- HC595
- SSR OUTPUTS
- IR LEDS
- LEDS
- Title
- Size:
- Date:
- A4
- Number:
- Time:
- Revision:
- Sheet
- of
- File:

## Sheet HC595.SchDoc
size A4; DocumentNumber: 5; SheetNumber: ALT0056; SheetTotal: 21
Used 2 times, as channels IR/HC1, IR/HC2. Parts and nets are listed once, with the designators drawn on the sheet.
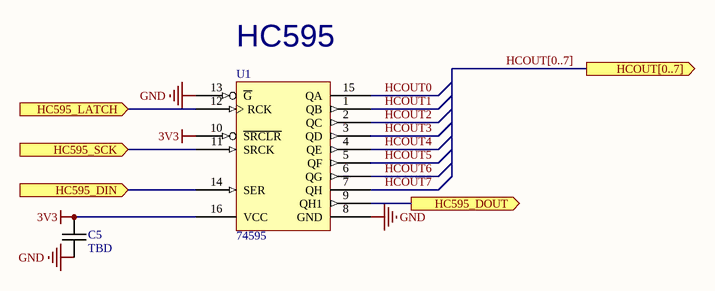
[diagram p12: HC595.SchDoc]

### Parts
C5  TBD  [1210C-GENERIC]
U1  74595  [SO16]

### Ports
HC595_DIN (in), HC595_DOUT (out), HC595_LATCH (in), HC595_SCK (in), HCOUT[0..7] (out)

### Nets
3V3: C5.1 U1.10(~{SRCLR}) U1.16(VCC)
GND: C5.2 U1.8(GND) U1.13(~{G})
HC595_DIN: U1.14(SER) ; port HC595_DIN
HC595_DOUT: U1.9(QH1) ; port HC595_DOUT
HC595_LATCH: U1.12(RCK) ; port HC595_LATCH
HC595_SCK: U1.11(SRCK) ; port HC595_SCK
HCOUT0: U1.15(QA)  [project net HCOUT0_ALT0056]
HCOUT1: U1.1(QB)  [project net HCOUT1_ALT0056]
HCOUT2: U1.2(QC)  [project net HCOUT2_ALT0056]
HCOUT3: U1.3(QD)  [project net HCOUT3_ALT0056]
HCOUT4: U1.4(QE)  [project net HCOUT4_ALT0056]
HCOUT5: U1.5(QF)  [project net HCOUT5_ALT0056]
HCOUT6: U1.6(QG)  [project net HCOUT6_ALT0056]
HCOUT7: U1.7(QH)  [project net HCOUT7_ALT0056]

### Channels
IR/HC1: designators end in A; ports HC595_DIN=DATA HC595_DOUT=HC595_DIN HC595_LATCH=HC595_LATCH HC595_SCK=HC595_SCK
IR/HC2: designators end in B; ports HC595_DIN=HC595_DIN HC595_DOUT=HC595_DOUT_HC2 HC595_LATCH=HC595_LATCH HC595_SCK=HC595_SCK

### Buses and harness runs
bus HCOUT[0..7] = port HCOUT[0..7]

### Notes on the sheet
- (near U1) HC595
- Title
- Size:
- Date:
- A4
- Number:
- Time:
- Revision:
- Sheet
- of
- File:

### Library data of the parts
C5 = Passives_Capacitors_1210_1210C-TBD: as C16 on sheet Power supply
U1 = 74595: 8-BIT SFT REG WIRTH OUTPUT LCH

## Sheet IR LEDS.SchDoc
size A4; DocumentNumber: 6; SheetNumber: ALT0056; SheetTotal: 21
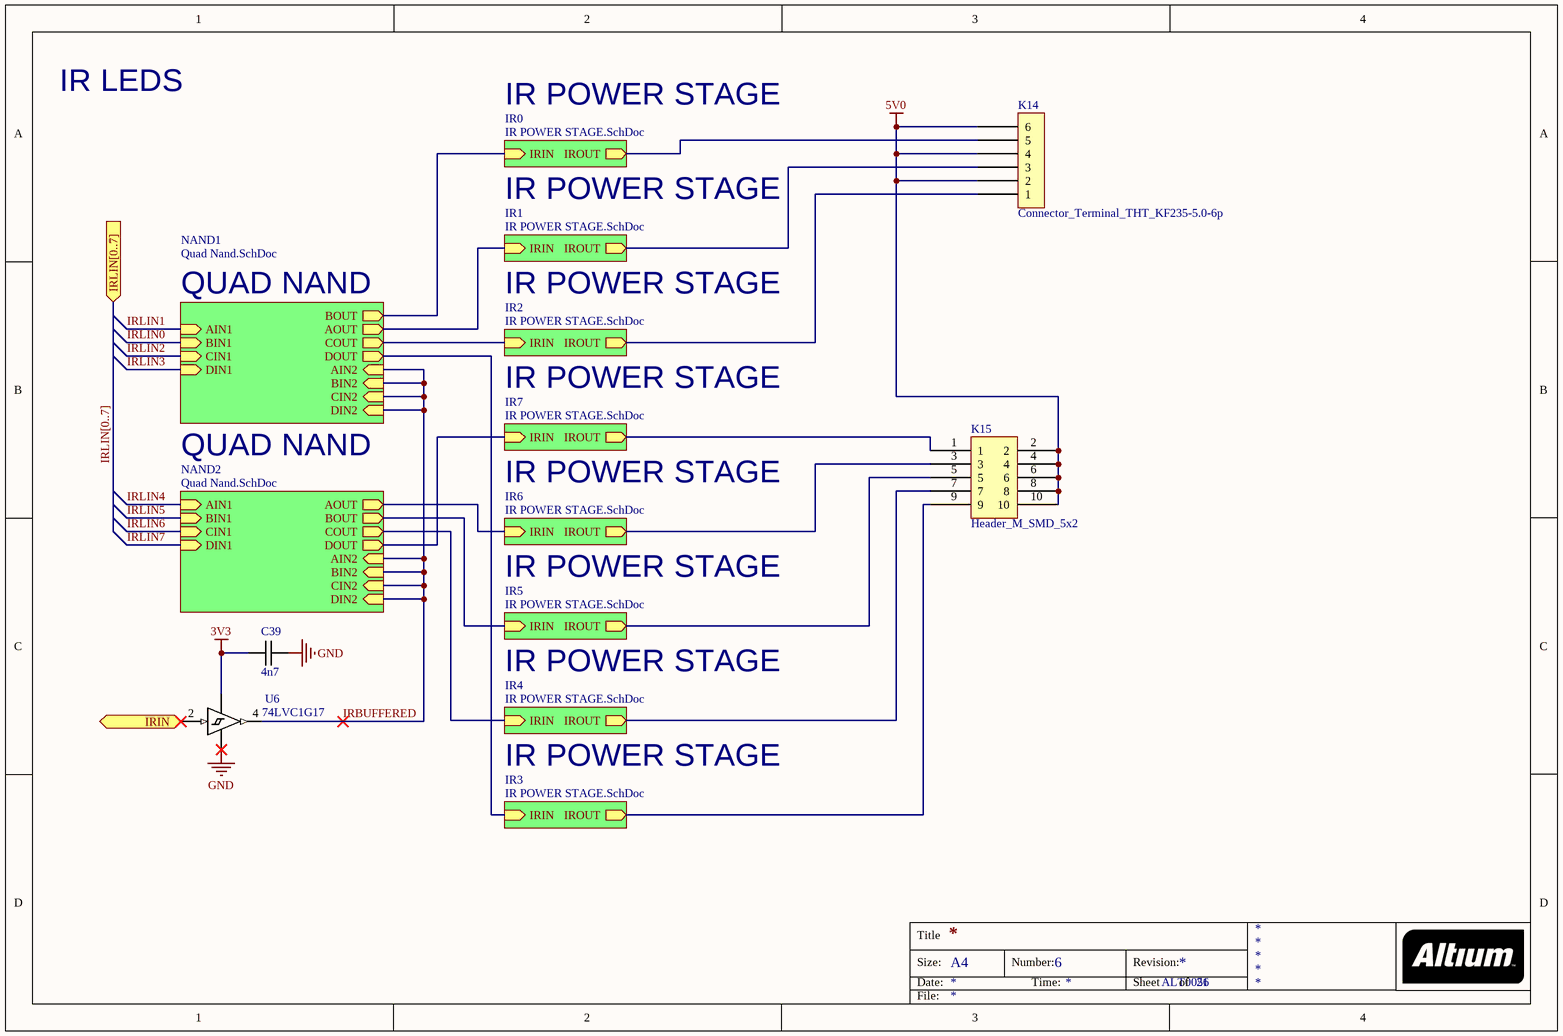
[diagram p13: IR LEDS.SchDoc]

### Parts
C39  4n7  [0603C-TBD]
K14  Connector_Terminal_THT_KF235-5.0-6p  [KF235-5.0-6p]
K15  Header_M_SMD_5x2  [Header_Male_2.54 5x2]
U6  74LVC1G17  [SOT-353]

### Sub-sheets
IR0 = IR POWER STAGE.SchDoc: IROUT (out), IRIN (in)
IR1 = IR POWER STAGE.SchDoc: IROUT (out), IRIN (in)
IR2 = IR POWER STAGE.SchDoc: IROUT (out), IRIN (in)
IR3 = IR POWER STAGE.SchDoc: IROUT (out), IRIN (in)
IR4 = IR POWER STAGE.SchDoc: IROUT (out), IRIN (in)
IR5 = IR POWER STAGE.SchDoc: IROUT (out), IRIN (in)
IR6 = IR POWER STAGE.SchDoc: IROUT (out), IRIN (in)
IR7 = IR POWER STAGE.SchDoc: IROUT (out), IRIN (in)
NAND1 = Quad Nand.SchDoc: BIN1 (in), BIN2 (in), BOUT (out), CIN1 (in), CIN2 (in), DIN1 (in), DIN2 (in), AIN1 (in), AIN2 (in), COUT (out), DOUT (out), AOUT (out)
NAND2 = Quad Nand.SchDoc: BIN1 (in), BIN2 (in), BOUT (out), CIN1 (in), CIN2 (in), DIN1 (in), DIN2 (in), AIN1 (in), AIN2 (in), COUT (out), DOUT (out), AOUT (out)

### Ports
IRIN (in), IRLIN[0..7] (in)

### Nets
3V3: C39.1 U6.5(VCC)
5V0: K14.2 K14.4 K14.6 K15.2 K15.4 K15.6 K15.8 K15.10
GND: C39.2 U6.3(GND)
AOUT: sheet NAND1/AOUT, sheet IR1/IRIN
AOUT: sheet NAND2/AOUT, sheet IR6/IRIN  [a separate net that carries the same name]
BOUT: sheet NAND1/BOUT, sheet IR0/IRIN
BOUT: sheet NAND2/BOUT, sheet IR5/IRIN  [a separate net that carries the same name]
COUT: sheet NAND1/COUT, sheet IR2/IRIN
COUT: sheet NAND2/COUT, sheet IR4/IRIN  [a separate net that carries the same name]
DOUT: sheet NAND1/DOUT, sheet IR3/IRIN
DOUT: sheet NAND2/DOUT, sheet IR7/IRIN  [a separate net that carries the same name]
IR_OSC: U6.2(A) ; port IRIN
IRBUFFERED: U6.4(Y) ; sheet NAND1/BIN2, sheet NAND1/CIN2, sheet NAND1/DIN2, sheet NAND1/AIN2, sheet NAND2/BIN2, sheet NAND2/CIN2, sheet NAND2/DIN2, sheet NAND2/AIN2
IROUT: K14.5 ; sheet IR0/IROUT
IROUT: K14.3 ; sheet IR1/IROUT  [a separate net that carries the same name]
IROUT: K14.1 ; sheet IR2/IROUT  [a separate net that carries the same name]
IROUT: K15.1 ; sheet IR7/IROUT  [a separate net that carries the same name]
IROUT: K15.3 ; sheet IR6/IROUT  [a separate net that carries the same name]
IROUT: K15.5 ; sheet IR5/IROUT  [a separate net that carries the same name]
IROUT: K15.7 ; sheet IR4/IROUT  [a separate net that carries the same name]
IROUT: K15.9 ; sheet IR3/IROUT  [a separate net that carries the same name]

### Buses and harness runs
bus IRLIN[0..7] = port IRLIN[0..7]

### Notes on the sheet
- IR LEDS
- IR POWER STAGE
- QUAD NAND
- Title
- Size:
- Date:
- A4
- Number:
- Time:
- Revision:
- Sheet
- of
- File:

### Library data of the parts
C39 = 0603C-4N7: CAPACITOR 0603 CERAMIC; REEL: C83; Supplier 1: Digi-Key; Supplier Part Number 1: 445-5086-2-ND
K15 = Header_M_SMD_5x2: SMD Header 5x2
U6 = 74LVC1G17: Single buffer

## Sheet Quad Nand.SchDoc
size A4; DocumentNumber: 8; SheetNumber: ALT0056; SheetTotal: 21
Used 2 times, as channels IR/IRL/NAND1, IR/IRL/NAND2. Parts and nets are listed once, with the designators drawn on the sheet.
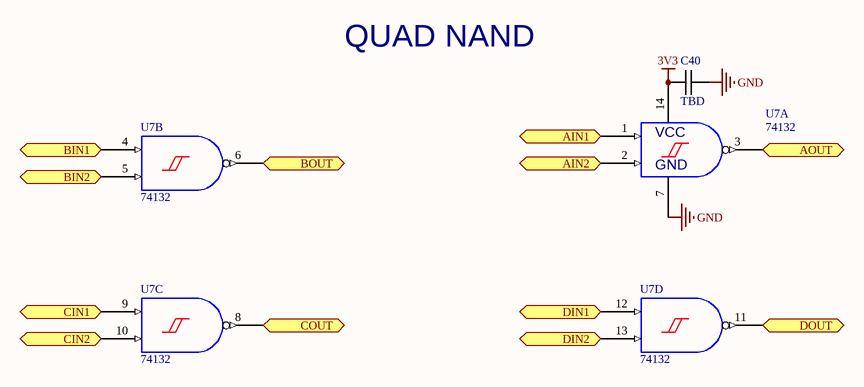
[diagram p14: Quad Nand.SchDoc]

### Parts
C40  TBD  [1210C-GENERIC]
U7  74132  [SSOP14]  (parts A,B,C,D of 4)

### Ports
AIN1 (in), AIN2 (in), AOUT (out), BIN1 (in), BIN2 (in), BOUT (out), CIN1 (in), CIN2 (in), COUT (out), DIN1 (in), DIN2 (in), DOUT (out)

### Nets
3V3: C40.1 U7.14(VCC)
GND: C40.2 U7.7(GND)
AIN1: U7.1 ; port AIN1
AIN2: U7.2 ; port AIN2
AOUT: U7.3 ; port AOUT
BIN1: U7.4 ; port BIN1
BIN2: U7.5 ; port BIN2
BOUT: U7.6 ; port BOUT
CIN1: U7.9 ; port CIN1
CIN2: U7.10 ; port CIN2
COUT: U7.8 ; port COUT
DIN1: U7.12 ; port DIN1
DIN2: U7.13 ; port DIN2
DOUT: U7.11 ; port DOUT

### Channels
IR/IRL/NAND1: designators end in A; ports AIN1=HCOUT1 AIN2=IRBUFFERED AOUT=AOUT BIN1=HCOUT0 BIN2=IRBUFFERED BOUT=BOUT CIN1=HCOUT2 CIN2=IRBUFFERED COUT=COUT DIN1=HCOUT3 DIN2=IRBUFFERED DOUT=DOUT
IR/IRL/NAND2: designators end in B; ports AIN1=HCOUT4 AIN2=IRBUFFERED AOUT=AOUT BIN1=HCOUT5 BIN2=IRBUFFERED BOUT=BOUT CIN1=HCOUT6 CIN2=IRBUFFERED COUT=COUT DIN1=HCOUT7 DIN2=IRBUFFERED DOUT=DOUT

### Notes on the sheet
- QUAD NAND
- Title
- Size:
- Date:
- A4
- Number:
- Time:
- Revision:
- Sheet
- of
- File:

### Library data of the parts
C40 = Passives_Capacitors_1210_1210C-TBD: as C16 on sheet Power supply
U7 = 74132: QUAD 2-IN POS NAND SCH

## Sheet IR POWER STAGE.SchDoc
size A4; DocumentNumber: 7; SheetNumber: ALT0056; SheetTotal: 21
Used 8 times, as channels IR/IRL/IR0, IR/IRL/IR1, IR/IRL/IR2, IR/IRL/IR3, IR/IRL/IR4, IR/IRL/IR5, IR/IRL/IR6, IR/IRL/IR7. Parts and nets are listed once, with the designators drawn on the sheet.
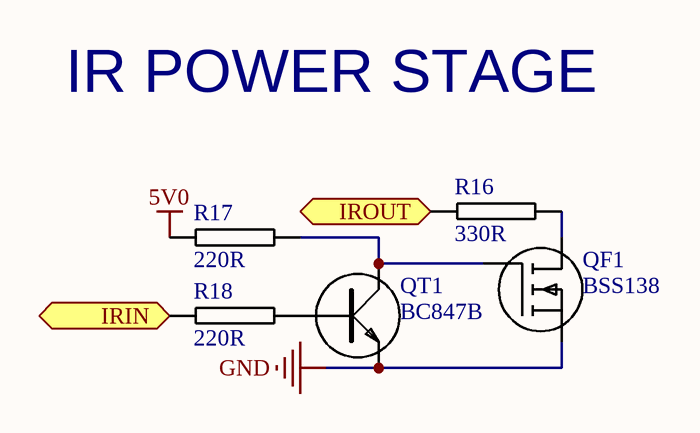
[diagram p15: IR POWER STAGE.SchDoc]

### Parts
QF1  BSS138  [SOT23-GDS]
QT1  BC847B  [SOT23-BCE]
R16  330R  [0805R-330]
R17  220R  [0805R-220]
R18  220R  [0805R-220]

### Ports
IRIN (in), IROUT (out)

### Nets
5V0: R17.1
GND: QF1.S QT1.E
IRIN: R18.1 ; port IRIN
IROUT: R16.1 ; port IROUT
NetQF1_D: QF1.D R16.2
NetQF1_G: QF1.G QT1.C R17.2
NetQT1_B: QT1.B R18.2

### Channels
IR/IRL/IR0: designators end in A; ports IRIN=BOUT IROUT=IROUT
IR/IRL/IR1: designators end in B; ports IRIN=AOUT IROUT=IROUT
IR/IRL/IR2: designators end in C; ports IRIN=COUT IROUT=IROUT
IR/IRL/IR3: designators end in D; ports IRIN=DOUT IROUT=IROUT
IR/IRL/IR4: designators end in E; ports IRIN=COUT IROUT=IROUT
IR/IRL/IR5: designators end in F; ports IRIN=BOUT IROUT=IROUT
IR/IRL/IR6: designators end in G; ports IRIN=AOUT IROUT=IROUT
IR/IRL/IR7: designators end in H; ports IRIN=DOUT IROUT=IROUT

### Notes on the sheet
- IR POWER STAGE
- Title
- Size:
- Date:
- A4
- Number:
- Time:
- Revision:
- Sheet
- of
- File:

### Library data of the parts
QF1 = BSS138-SOT23: as Q1 on sheet WS2812B Single Channel; Supplier 1: Digi-Key; Supplier Part Number 1: 2N7002NTR-ND; Package / Case: SOT-23-3, TO-236-3, Micro3™, SSD3, SST3; RoHS: RoHS Compliant; Mounting Type: Surface Mount; Packaging: Tape & Reel (TR); Gate Charge (Qg) @ Vgs: -; Supplier Part Number: 2N7002NTR-ND; Supplier: Digi-Key; Category: Discrete Semiconductor Products
QT1 = BC847: BC847 SMALL SIGNAL NPN TRANSISTOR; Manufacturer Part Number: BC847BMTF; Manufacturer: Fairchild Semiconductor; Current - Collector (Ic) (Max): 100mA; Frequency - Transition: 300MHz; Vce Saturation (Max) @ Ib, Ic: 200mV @ 5mA, 100mA; Voltage - Collector Emitter Breakdown (Max): 45V; Power - Max: 310mW; DC Current Gain (hFE) (Min) @ Ic, Vce: 200 @ 2mA, 5V; Supplier 1: Digi-Key; Supplier Part Number 1: BC847BMTFCT-ND; RoHS: RoHS Compliant; Transistor Type: NPN; Mounting Type: Surface Mount; Packaging: Cut Tape (CT); Package / Case: SOT-23-3, TO-236-3, Micro3™, SSD3, SST3; Current - Collector Cutoff (Max): -; Supplier: Digi-Key; Category: Discrete Semiconductor Products; Supplier Part Number: BC847BMTFCT-ND
R16 = 0805R-330: RESISTOR 0805 1/4 WATT THIN FILM; Reel: *
R17 R18 = 0805R-220: RESISTOR 0805 1/4 WATT THIN FILM; Reel: *

## Sheet SSR OUTPUTS.SchDoc
size A4; DocumentNumber: 9; SheetNumber: ALT0056; SheetTotal: 21
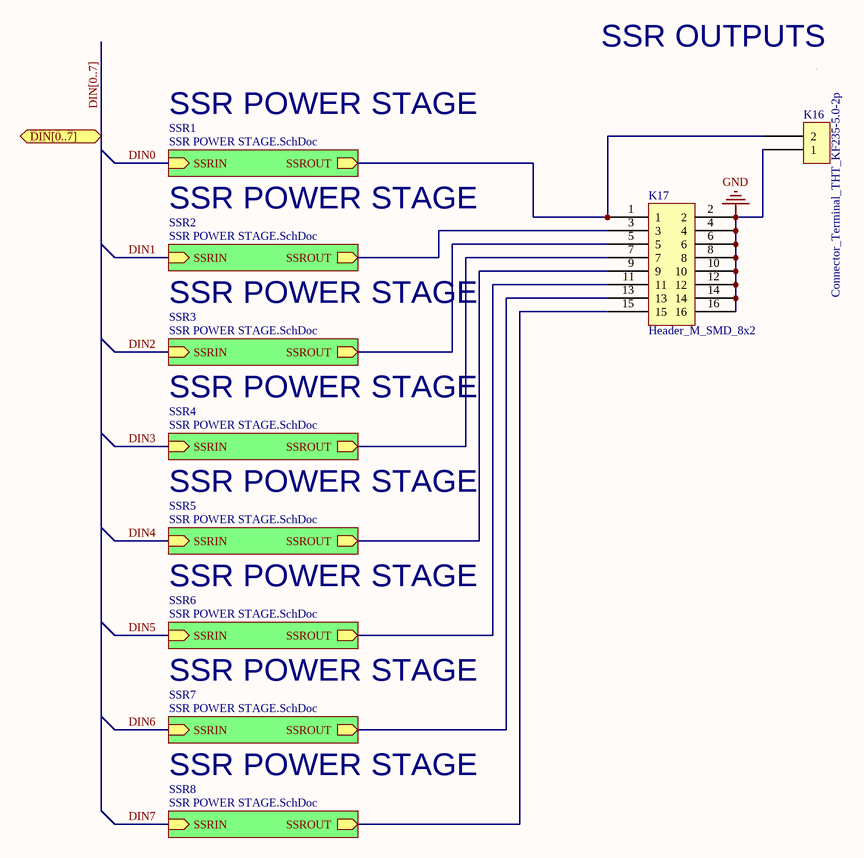
[diagram p16: SSR OUTPUTS.SchDoc]

### Parts
K16  Connector_Terminal_THT_KF235-5.0-2p  [KF235-5.0-2p]
K17  Header_M_SMD_8x2  [Header_Male_2.54 8x2]

### Sub-sheets
SSR1 = SSR POWER STAGE.SchDoc: SSROUT (out), SSRIN (in)
SSR2 = SSR POWER STAGE.SchDoc: SSROUT (out), SSRIN (in)
SSR3 = SSR POWER STAGE.SchDoc: SSROUT (out), SSRIN (in)
SSR4 = SSR POWER STAGE.SchDoc: SSROUT (out), SSRIN (in)
SSR5 = SSR POWER STAGE.SchDoc: SSROUT (out), SSRIN (in)
SSR6 = SSR POWER STAGE.SchDoc: SSROUT (out), SSRIN (in)
SSR7 = SSR POWER STAGE.SchDoc: SSROUT (out), SSRIN (in)
SSR8 = SSR POWER STAGE.SchDoc: SSROUT (out), SSRIN (in)

### Ports
DIN[0..7] (in)

### Nets
GND: K16.1 K17.2 K17.4 K17.6 K17.8 K17.10 K17.12 K17.14 K17.16
SSROUT: K16.2 K17.1 ; sheet SSR1/SSROUT
SSROUT: K17.3 ; sheet SSR2/SSROUT  [a separate net that carries the same name]
SSROUT: K17.5 ; sheet SSR3/SSROUT  [a separate net that carries the same name]
SSROUT: K17.7 ; sheet SSR4/SSROUT  [a separate net that carries the same name]
SSROUT: K17.9 ; sheet SSR5/SSROUT  [a separate net that carries the same name]
SSROUT: K17.11 ; sheet SSR6/SSROUT  [a separate net that carries the same name]
SSROUT: K17.13 ; sheet SSR7/SSROUT  [a separate net that carries the same name]
SSROUT: K17.15 ; sheet SSR8/SSROUT  [a separate net that carries the same name]

### Buses and harness runs
bus DIN[0..7] = port DIN[0..7]

### Notes on the sheet
- SSR OUTPUTS
- SSR POWER STAGE
- Title
- Size:
- Date:
- A4
- Number:
- Time:
- Revision:
- Sheet
- of
- File:

### Library data of the parts
K17 = Header_M_SMD_8x2: SMD Header 8x2

## Sheet SSR POWER STAGE.SchDoc
size A4; DocumentNumber: 10; SheetNumber: ALT0056; SheetTotal: 21
Used 8 times, as channels IR/SSR/SSR1, IR/SSR/SSR2, IR/SSR/SSR3, IR/SSR/SSR4, IR/SSR/SSR5, IR/SSR/SSR6, IR/SSR/SSR7, IR/SSR/SSR8. Parts and nets are listed once, with the designators drawn on the sheet.
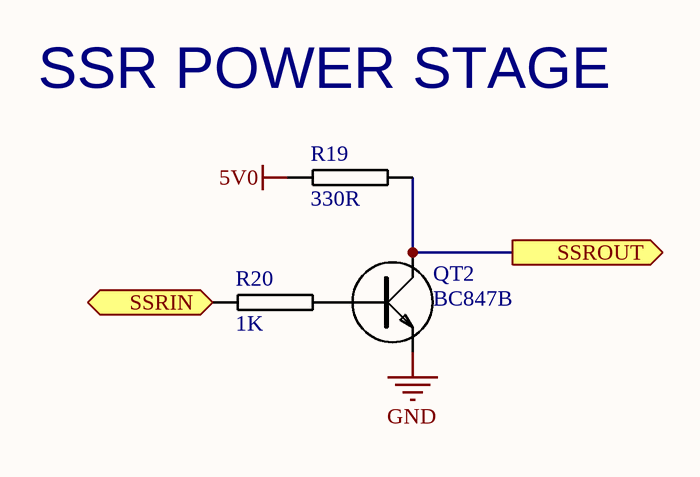
[diagram p17: SSR POWER STAGE.SchDoc]

### Parts
QT2  BC847B  [SOT23-BCE]
R19  330R  [0805R-330]
R20  1K  [0805R-1K]

### Ports
SSRIN (in), SSROUT (out)

### Nets
5V0: R19.1
GND: QT2.E
SSRIN: R20.1 ; port SSRIN
SSROUT: QT2.C R19.2 ; port SSROUT
NetQT2_B: QT2.B R20.2

### Channels
IR/SSR/SSR1: designators end in A; ports SSRIN=DIN0 SSROUT=SSROUT
IR/SSR/SSR2: designators end in B; ports SSRIN=DIN1 SSROUT=SSROUT
IR/SSR/SSR3: designators end in C; ports SSRIN=DIN2 SSROUT=SSROUT
IR/SSR/SSR4: designators end in D; ports SSRIN=DIN3 SSROUT=SSROUT
IR/SSR/SSR5: designators end in E; ports SSRIN=DIN4 SSROUT=SSROUT
IR/SSR/SSR6: designators end in F; ports SSRIN=DIN5 SSROUT=SSROUT
IR/SSR/SSR7: designators end in G; ports SSRIN=DIN6 SSROUT=SSROUT
IR/SSR/SSR8: designators end in H; ports SSRIN=DIN7 SSROUT=SSROUT

### Notes on the sheet
- (near R19) SSR POWER STAGE
- Title
- Size:
- Date:
- A4
- Number:
- Time:
- Revision:
- Sheet
- of
- File:

### Library data of the parts
QT2 = BC847: as QT1 on sheet IR POWER STAGE; Supplier 1: Digi-Key; Supplier Part Number 1: BC847BMTFCT-ND; RoHS: RoHS Compliant; Transistor Type: NPN; Mounting Type: Surface Mount; Packaging: Cut Tape (CT); Package / Case: SOT-23-3, TO-236-3, Micro3™, SSD3, SST3; Current - Collector Cutoff (Max): -; Supplier: Digi-Key; Category: Discrete Semiconductor Products; Supplier Part Number: BC847BMTFCT-ND
R19 = 0805R-330: RESISTOR 0805 1/4 WATT THIN FILM; Reel: *
R20 = 0805R-1K: RESISTOR 0805 1/4 WATT THIN FILM; Reel: *

## Sheet Clocks.SchDoc
size A4; DocumentNumber: 2; SheetNumber: ALT0056; SheetTotal: 21
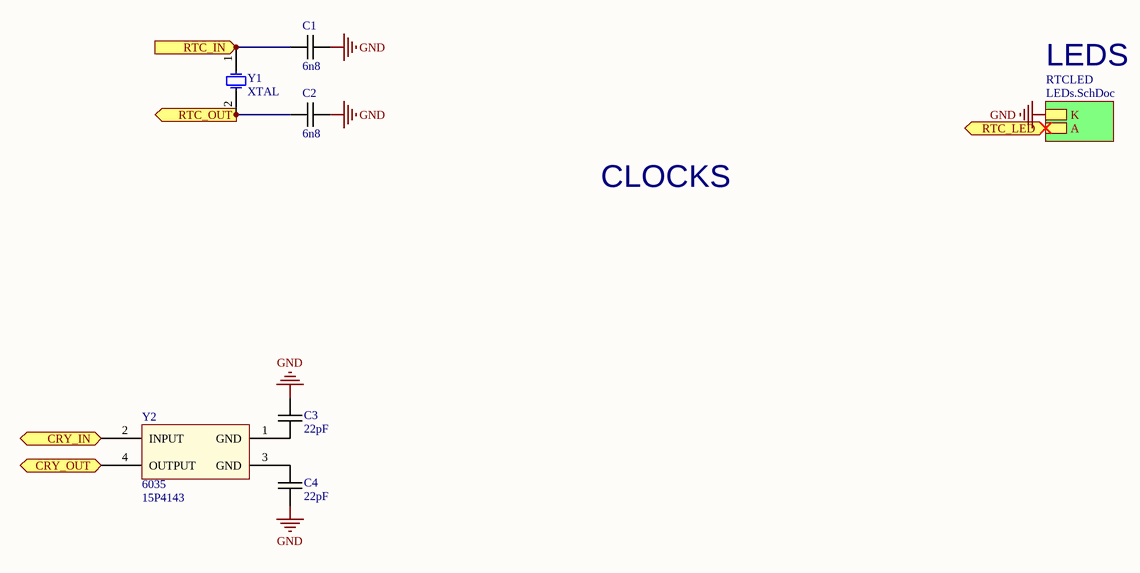
[diagram p18: Clocks.SchDoc]

### Parts
C1  6n8  [0603C-GENERIC]
C2  6n8  [0603C-GENERIC]
C3  22pF  [0603C-GENERIC]
C4  22pF  [0603C-GENERIC]
Y1  XTAL  [R38]
Y2  6035  Supplier Part Number 1: 15P4143  [XTAL 6035]

### Sub-sheets
RTCLED = LEDs.SchDoc: K, A

### Ports
CRY_IN (in), CRY_OUT (out), RTC_IN (in), RTC_LED (in), RTC_OUT (out)

### Nets
GND: C1.1 C2.1 C3.1 C4.2 ; sheet RTCLED/K
CRY_IN: Y2.2(INPUT) ; port CRY_IN
CRY_OUT: Y2.4(OUTPUT) ; port CRY_OUT
RTC_IN: C1.2 Y1.1(OSC1) ; port RTC_IN
RTC_IN_MCU: C2.2 Y1.2(OSC2) ; port RTC_OUT
RTC_LED: port RTC_LED, sheet RTCLED/A
NetC3_2: C3.2 Y2.1(GND)
NetC4_1: C4.1 Y2.3(GND)

### Notes on the sheet
- LEDS
- CLOCKS
- Title
- Size:
- Date:
- A4
- Number:
- Time:
- Revision:
- Sheet
- of
- File:

### Library data of the parts
C1 C2 = 0603C-6N850V-X7R-MUR: CAPACITOR 0603 CERAMIC; Manufacturer: Murata Electronics North America; Manufacturer Part Number: GRM188R71H682KA01D; Reel: C35; Supplier 1: Digi-Key; Supplier Part Number 1: 490-1508-2-ND
C3 C4 = 0603C-22PF-50V-C0G-PAN: CAPACITOR 0603 CERAMIC; Manufacturer Part Number: ECJ-1VC1H220J; Manufacturer: Panasonic - ECG; Reel: C10; Tolerance: ±5%; Temperature Coefficient: C0G, NP0; Voltage - Rated: 50V; Supplier 1: Digi-Key; Features: General Purpose; Lead Spacing: -; Supplier: Digi-Key; Capacitance: 22pF; Packaging: Tape & Reel (TR); Mounting Type: Surface Mount, MLCC; RoHS: RoHS Compliant; Operating Temperature: -55°C ~ 125°C; Thickness: 0.80mm; Package / Case: 0603 (1608 metric); Category: Capacitors; Supplier Part Number 1: PCC220ACVTR-ND; Supplier Part Number: PCC220ACVTR-ND
Y1 = XTAL: Crystal Oscillator; Published: 8-Jun-2000; LatestRevisionDate: 17-Jul-2002; LatestRevisionNote: Re-released for DXP Platform.; PackageReference: R38; Publisher: Altium Limited; PackageDescription: Crystal, Thru-Hole; 2 Leads; Body 3.1 x 8.2 mm (Dia.xH)
Y2 = 6035 Quartz: Supplier 1: Newark

## Sheet SD.SchDoc
size A4; DocumentNumber: 18; SheetNumber: ALT0056; SheetTotal: 21
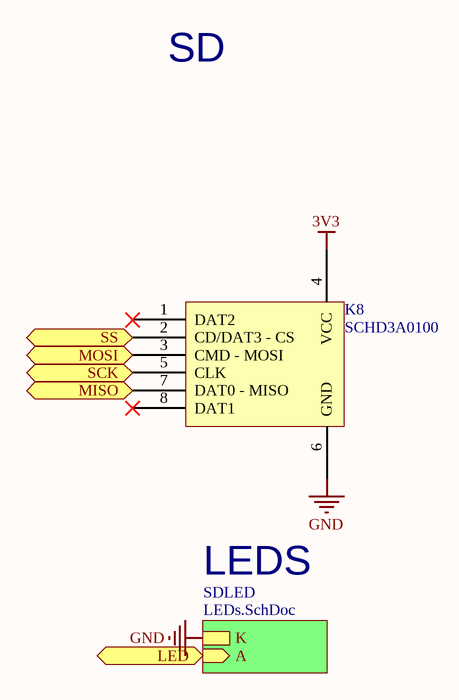
[diagram p19: SD.SchDoc]

### Parts
K8  SCHD3A0100  [SCHD3A0100]

### Sub-sheets
SDLED = LEDs.SchDoc: K, A (in)

### Ports
LED (in), MISO (out), MOSI (in), SCK (in), SS (in)

### Nets
3V3: K8.4(VCC)
GND: K8.6(GND) ; sheet SDLED/K
LED: port LED, sheet SDLED/A
MISO: K8.7(DAT0_-_MISO) ; port MISO
MOSI: K8.3(CMD_-_MOSI) ; port MOSI
OLED_SCK/SD_SCK: K8.5(CLK) ; port SCK
SD_SS: K8.2(CD/DAT3_-_CS) ; port SS

Not connected (* = marked no-connect by the designer): K8 1(DAT2)* 8(DAT1)*

### Notes on the sheet
- SD
- LEDS
- Title
- Size:
- Date:
- A4
- Number:
- Time:
- Revision:
- Sheet
- of
- File:

## Sheet OLED.SchDoc
size A4; DocumentNumber: 13; SheetNumber: ALT0056; SheetTotal: 21
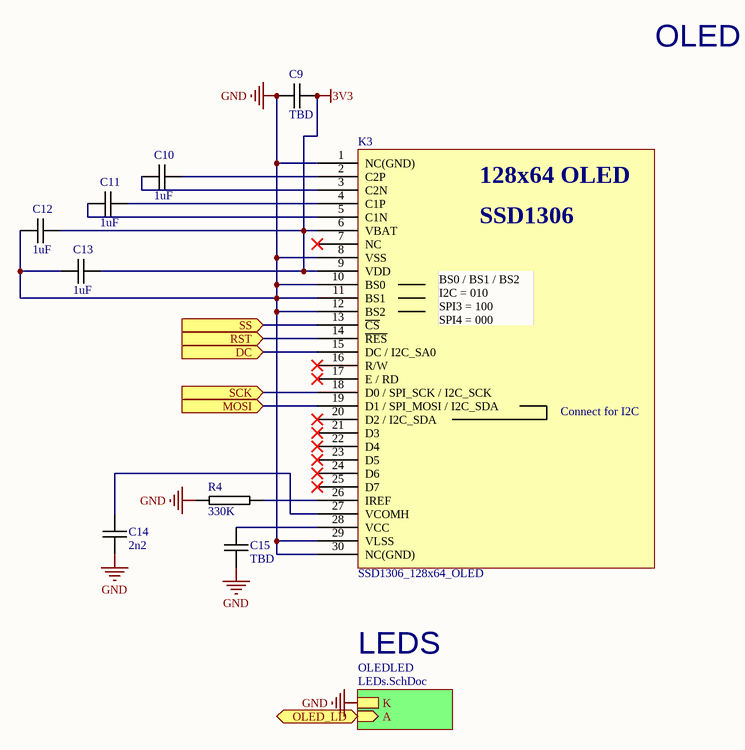
[diagram p20: OLED.SchDoc]

### Parts
C9  TBD  [1210C-GENERIC]
C10  1uF  [0603C-GENERIC]
C11  1uF  [0603C-GENERIC]
C12  1uF  [0603C-GENERIC]
C13  1uF  [0603C-GENERIC]
C14  2n2  [0603C-GENERIC]
C15  TBD  [1210C-GENERIC]
K3  SSD1306_128x64_OLED  [SSD1306_128x64_OLED]
R4  330K  [0603R-330K]

### Sub-sheets
OLEDLED = LEDs.SchDoc: K, A (in)

### Ports
DC (in), MOSI (in), OLED_LD (in), RST (in), SCK (in), SS (in)

### Nets
3V3: C9.2 C12.2 C13.2 K3.6(VBAT) K3.9(VDD)
GND: C9.1 C12.1 C13.1 C14.2 C15.1 K3.1(NC(GND)) K3.8(VSS) K3.10(BS0) K3.11(BS1) K3.12(BS2) K3.29(VLSS) K3.30(NC(GND)) R4.1 ; sheet OLEDLED/K
DC: K3.15(DC_/_I2C_SA0) ; port DC
MOSI: K3.19(D1_/_SPI_MOSI_/_I2C_SDA) ; port MOSI
OLED_LD: port OLED_LD, sheet OLEDLED/A
OLED_RST: K3.14(~{RES}) ; port RST
OLED_SCK/SD_SCK: K3.18(D0_/_SPI_SCK_/_I2C_SCK) ; port SCK
OLED_SS: K3.13(~{CS}) ; port SS
NetC10_1: C10.1 K3.3(C2N)
NetC10_2: C10.2 K3.2(C2P)
NetC11_1: C11.1 K3.5(C1N)
NetC11_2: C11.2 K3.4(C1P)
NetC14_1: C14.1 K3.27(VCOMH)
NetC15_2: C15.2 K3.28(VCC)
NetK3_26: K3.26(IREF) R4.2

Not connected (* = marked no-connect by the designer): K3 7(NC)* 16(R/W)* 17(E_/_RD)* 20(D2_/_I2C_SDA)* 21(D3)* 22(D4)* 23(D5)* 24(D6)* 25(D7)*

### Notes on the sheet
- OLED
- LEDS
- Title
- Size:
- Date:
- A4
- Number:
- Time:
- Revision:
- Sheet
- of
- File:
- (in symbol SSD1306_128x64_OLED) 128x64 OLED; SSD1306; BS0 / BS1 / BS2 / I2C = 010 / SPI3 = 100 / SPI4 = 000; Connect for I2C

### Library data of the parts
C9 C15 = Passives_Capacitors_1210_1210C-TBD: as C16 on sheet Power supply
C10-C13 = 0603C-1UF-35V-X5R-TAY: CAPACITOR 0603 CERAMIC; Manufacturer Part Number: GMK107BJ105KA-T; Manufacturer: Taiyo Yuden; Reel: C92; Supplier 1: Digi-Key; Supplier Part Number 1: 587-1437-2-ND
C14 = 0603C-2N2-50V-C0G-MUR: CAPACITOR 0603 CERAMIC; Reel: C4
K3 = SSD1306_128x64_OLED: SSD1306 OLED 128x64
R4 = 0603R-330K: GENERIC RESISTOR 0603; Manufacturer: Stackpole Electronics Inc; Manufacturer Part Number: RMCF 1/16 330K 1% R; Temperature Coefficient: ±100ppm/°C; Power (Watts): 0.1W, 1/10W; Tolerance: ±1%; Supplier 1: Digi-Key; Supplier Part Number 1: RMCF1/16330KFRCT-ND; Resistance In Ohms: 330K; Supplier Part Number: RMCF1/16330KFRCT-ND; Packaging: Cut Tape (CT); RoHS: RoHS Compliant; Composition: Thick Film; Supplier: Digi-Key; Lead Style: Surface Mount (SMD - SMT); Category: Resistors; Case: 0603 (1608 metric)

## Nets that join several sheets
3V3: Power supply (5 pins), PS/3V30 (R21A.2), WS/CH1 (C25A.1 Q1A.G R6A.1 U3A.5), WS/CH2 (C25B.1 Q1B.G R6B.1 U3B.5), Pushbuttons (5 pins), Microcontroller (10 pins), nRF24L01p (C6.2 C7.2 C8.1 K2.2), IR/HC1 (C5A.1 U1A.10 U1A.16), IR/HC2 (C5B.1 U1B.10 U1B.16), IR LEDS (C39.1 U6.5), IR/IRL/NAND1 (C40A.1 U7A.14), IR/IRL/NAND2 (C40B.1 U7B.14), SD (K8.4), OLED (5 pins)
5V0: Power supply (C16.1 C17.1 VR1.2 VR1.4), PS/5V00 (R21B.2), WS2812B (K9.2 K9.5), WS/CH1 (Q2A.G R7A.1), WS/CH2 (Q2B.G R7B.1), IR LEDS (8 pins), IR/IRL/IR0 (R17A.1), IR/IRL/IR1 (R17B.1), IR/IRL/IR2 (R17C.1), IR/IRL/IR3 (R17D.1), IR/IRL/IR4 (R17E.1), IR/IRL/IR5 (R17F.1), IR/IRL/IR6 (R17G.1), IR/IRL/IR7 (R17H.1), IR/SSR/SSR1 (R19A.1), IR/SSR/SSR2 (R19B.1), IR/SSR/SSR3 (R19C.1), IR/SSR/SSR4 (R19D.1), IR/SSR/SSR5 (R19E.1), IR/SSR/SSR6 (R19F.1), IR/SSR/SSR7 (R19G.1), IR/SSR/SSR8 (R19H.1)
GND: General Overview (30 pins), Power supply (15 pins), PS/BAT1 (C24A.1 K10A.1 R5A.1 U2A.3), PS/BAT2 (C24B.1 K10B.1 R5B.1 U2B.3), PS/3V30 (D10A.K), PS/5V00 (D10B.K), WS2812B (K9.1 K9.4), WS/CH1 (C25A.2 U3A.3), WS/CH2 (C25B.2 U3B.3), Pushbuttons (10 pins), Microcontroller (12 pins), UART (9 pins), nRF24L01p (C6.1 C7.1 C8.2 K2.1), nRF/nRFLED (D2E.K K1E.1), IR/HC1 (C5A.2 U1A.8 U1A.13), IR/HC2 (C5B.2 U1B.8 U1B.13), IR/IRLED (D2F.K K1F.1), IR LEDS (C39.2 U6.3), IR/IRL/NAND1 (C40A.2 U7A.7), IR/IRL/NAND2 (C40B.2 U7B.7), IR/IRL/IR0 (QF1A.S QT1A.E), IR/IRL/IR1 (QF1B.S QT1B.E), IR/IRL/IR2 (QF1C.S QT1C.E), IR/IRL/IR3 (QF1D.S QT1D.E), IR/IRL/IR4 (QF1E.S QT1E.E), IR/IRL/IR5 (QF1F.S QT1F.E), IR/IRL/IR6 (QF1G.S QT1G.E), IR/IRL/IR7 (QF1H.S QT1H.E), SSR OUTPUTS (9 pins), IR/SSR/SSR1 (QT2A.E), IR/SSR/SSR2 (QT2B.E), IR/SSR/SSR3 (QT2C.E), IR/SSR/SSR4 (QT2D.E), IR/SSR/SSR5 (QT2E.E), IR/SSR/SSR6 (QT2F.E), IR/SSR/SSR7 (QT2G.E), IR/SSR/SSR8 (QT2H.E), Clocks (C1.1 C2.1 C3.1 C4.2), CLK/RTCLED (D2G.K K1G.1), SD (K8.6), SD/SDLED (D2H.K K1H.1), OLED (13 pins), OLED/OLEDLED (D2I.K K1I.1)
AOUT: IR/IRL/NAND1 (U7A.3), IR/IRL/IR1 (R18B.1)
AOUT: IR/IRL/NAND2 (U7B.3), IR/IRL/IR6 (R18G.1)
BOUT: IR/IRL/NAND1 (U7A.6), IR/IRL/IR0 (R18A.1)
BOUT: IR/IRL/NAND2 (U7B.6), IR/IRL/IR5 (R18F.1)
CH1_IN: WS/CH1 (U3A.2), Microcontroller (U5.29)
CH2_IN: WS/CH2 (U3B.2), Microcontroller (U5.30)
COUT: IR/IRL/NAND1 (U7A.8), IR/IRL/IR2 (R18C.1)
COUT: IR/IRL/NAND2 (U7B.8), IR/IRL/IR4 (R18E.1)
CRY_IN: Microcontroller (U5.6), Clocks (Y2.2)
CRY_OUT: Microcontroller (U5.5), Clocks (Y2.4)
DATA: Microcontroller (U5.41), IR/HC1 (U1A.14)
DC: Microcontroller (U5.19), OLED (K3.15)
DIN0: IR/HC2 (U1B.15), IR/SSR/SSR1 (R20A.1)
DIN1: IR/HC2 (U1B.1), IR/SSR/SSR2 (R20B.1)
DIN2: IR/HC2 (U1B.2), IR/SSR/SSR3 (R20C.1)
DIN3: IR/HC2 (U1B.3), IR/SSR/SSR4 (R20D.1)
DIN4: IR/HC2 (U1B.4), IR/SSR/SSR5 (R20E.1)
DIN5: IR/HC2 (U1B.5), IR/SSR/SSR6 (R20F.1)
DIN6: IR/HC2 (U1B.6), IR/SSR/SSR7 (R20G.1)
DIN7: IR/HC2 (U1B.7), IR/SSR/SSR8 (R20H.1)
DOUT: IR/IRL/NAND1 (U7A.11), IR/IRL/IR3 (R18D.1)
DOUT: IR/IRL/NAND2 (U7B.11), IR/IRL/IR7 (R18H.1)
HC595_DIN: IR/HC1 (U1A.9), IR/HC2 (U1B.14)
HC595_LATCH: Microcontroller (U5.42), IR/HC1 (U1A.12), IR/HC2 (U1B.12)
HC595_SCK: Microcontroller (U5.43), IR/HC1 (U1A.11), IR/HC2 (U1B.11)
HCOUT0: IR/HC1 (U1A.15), IR/IRL/NAND1 (U7A.4)
HCOUT1: IR/HC1 (U1A.1), IR/IRL/NAND1 (U7A.1)
HCOUT2: IR/HC1 (U1A.2), IR/IRL/NAND1 (U7A.9)
HCOUT3: IR/HC1 (U1A.3), IR/IRL/NAND1 (U7A.12)
HCOUT4: IR/HC1 (U1A.4), IR/IRL/NAND2 (U7B.1)
HCOUT5: IR/HC1 (U1A.5), IR/IRL/NAND2 (U7B.4)
HCOUT6: IR/HC1 (U1A.6), IR/IRL/NAND2 (U7B.9)
HCOUT7: IR/HC1 (U1A.7), IR/IRL/NAND2 (U7B.12)
IR_LED: Microcontroller (U5.39), IR/IRLED (R3F.2)
IR_OSC: Microcontroller (U5.40), IR LEDS (U6.2)
IRBUFFERED: IR LEDS (U6.4), IR/IRL/NAND1 (U7A.2 U7A.5 U7A.10 U7A.13), IR/IRL/NAND2 (U7B.2 U7B.5 U7B.10 U7B.13)
IROUT: IR LEDS (K14.5), IR/IRL/IR0 (R16A.1)
IROUT: IR LEDS (K14.3), IR/IRL/IR1 (R16B.1)
IROUT: IR LEDS (K14.1), IR/IRL/IR2 (R16C.1)
IROUT: IR LEDS (K15.1), IR/IRL/IR7 (R16H.1)
IROUT: IR LEDS (K15.3), IR/IRL/IR6 (R16G.1)
IROUT: IR LEDS (K15.5), IR/IRL/IR5 (R16F.1)
IROUT: IR LEDS (K15.7), IR/IRL/IR4 (R16E.1)
IROUT: IR LEDS (K15.9), IR/IRL/IR3 (R16D.1)
K: PS/BAT1 (U2A.6), PS/BAT1/STBY (D2B.K K1B.1)
K: PS/BAT1 (U2A.7), PS/BAT1/CHRG (D2A.K K1A.1)
K: PS/BAT2 (U2B.6), PS/BAT2/STBY (D2D.K K1D.1)
K: PS/BAT2 (U2B.7), PS/BAT2/CHRG (D2C.K K1C.1)
LED: Microcontroller (U5.11), SD/SDLED (R3H.2)
LED_GREEN: General Overview (D1.A1), Microcontroller (U5.45)
LED_ORANGE: General Overview (D1.A2), Microcontroller (U5.46)
MISO: Microcontroller (U5.16), SD (K8.7)
MOSI: Microcontroller (U5.17), SD (K8.3), OLED (K3.19)
nRF24L01+_CE: Microcontroller (U5.21), nRF24L01p (K2.3)
nRF24L01+_CSN: Microcontroller (U5.25), nRF24L01p (K2.4)
nRF24L01+_IRQ: Microcontroller (U5.20), nRF24L01p (K2.8)
nRF24L01+_LED: Microcontroller (U5.22), nRF/nRFLED (R3E.2)
nRF24L01+_MISO: Microcontroller (U5.27), nRF24L01p (K2.7)
nRF24L01+_MOSI: Microcontroller (U5.28), nRF24L01p (K2.6)
nRF24L01+_SCK: Microcontroller (U5.26), nRF24L01p (K2.5)
OLED_LD: Microcontroller (U5.10), OLED/OLEDLED (R3I.2)
OLED_RST: Microcontroller (U5.18), OLED (K3.14)
OLED_SCK/SD_SCK: Microcontroller (U5.15), SD (K8.5), OLED (K3.18)
OLED_SS: Microcontroller (U5.38), OLED (K3.13)
PB0: Pushbuttons (C28.1 R11.1 SW1.1), Microcontroller (U5.36)
PB1: Pushbuttons (C29.1 R12.1 SW2.1), Microcontroller (U5.35)
PB2: Pushbuttons (C30.1 R13.1 SW3.1), Microcontroller (U5.33)
PB3: Pushbuttons (C31.1 R14.1 SW4.1), Microcontroller (U5.32)
PB4: Pushbuttons (C32.1 R15.1 SW5.1), Microcontroller (U5.31)
RTC_IN: Microcontroller (U5.4), Clocks (C1.2 Y1.1)
RTC_IN_MCU: Microcontroller (U5.3), Clocks (C2.2 Y1.2)
RTC_LED: Microcontroller (U5.2), CLK/RTCLED (R3G.2)
RX: Microcontroller (U5.13), UART (D8.K TP3.1 U4.26)
SD_SS: Microcontroller (U5.14), SD (K8.2)
SSROUT: SSR OUTPUTS (K16.2 K17.1), IR/SSR/SSR1 (QT2A.C R19A.2)
SSROUT: SSR OUTPUTS (K17.3), IR/SSR/SSR2 (QT2B.C R19B.2)
SSROUT: SSR OUTPUTS (K17.5), IR/SSR/SSR3 (QT2C.C R19C.2)
SSROUT: SSR OUTPUTS (K17.7), IR/SSR/SSR4 (QT2D.C R19D.2)
SSROUT: SSR OUTPUTS (K17.9), IR/SSR/SSR5 (QT2E.C R19E.2)
SSROUT: SSR OUTPUTS (K17.11), IR/SSR/SSR6 (QT2F.C R19F.2)
SSROUT: SSR OUTPUTS (K17.13), IR/SSR/SSR7 (QT2G.C R19G.2)
SSROUT: SSR OUTPUTS (K17.15), IR/SSR/SSR8 (QT2H.C R19H.2)
TX: Microcontroller (U5.12), UART (D7.K TP2.1 U4.25)
VBATOUT: Power supply (D5.1), PS/BAT1 (C24A.2 K11A.1 U2A.5)
VBATOUT: Power supply (D6.1), PS/BAT2 (C24B.2 K11B.1 U2B.5)
VBATRAWINPUT: Power supply (C22.1 K7.VCC), PS/BAT1 (U2A.4 U2A.8), PS/BAT1/CHRG (R3A.2), PS/BAT1/STBY (R3B.2), PS/BAT2 (U2B.4 U2B.8), PS/BAT2/CHRG (R3C.2), PS/BAT2/STBY (R3D.2)
WSOUT: WS2812B (K9.6), WS/CH1 (Q2A.D R7A.2)
WSOUT: WS2812B (K9.3), WS/CH2 (Q2B.D R7B.2)